# EAGLE design EDCPSU (EAGLE 9.5.2)
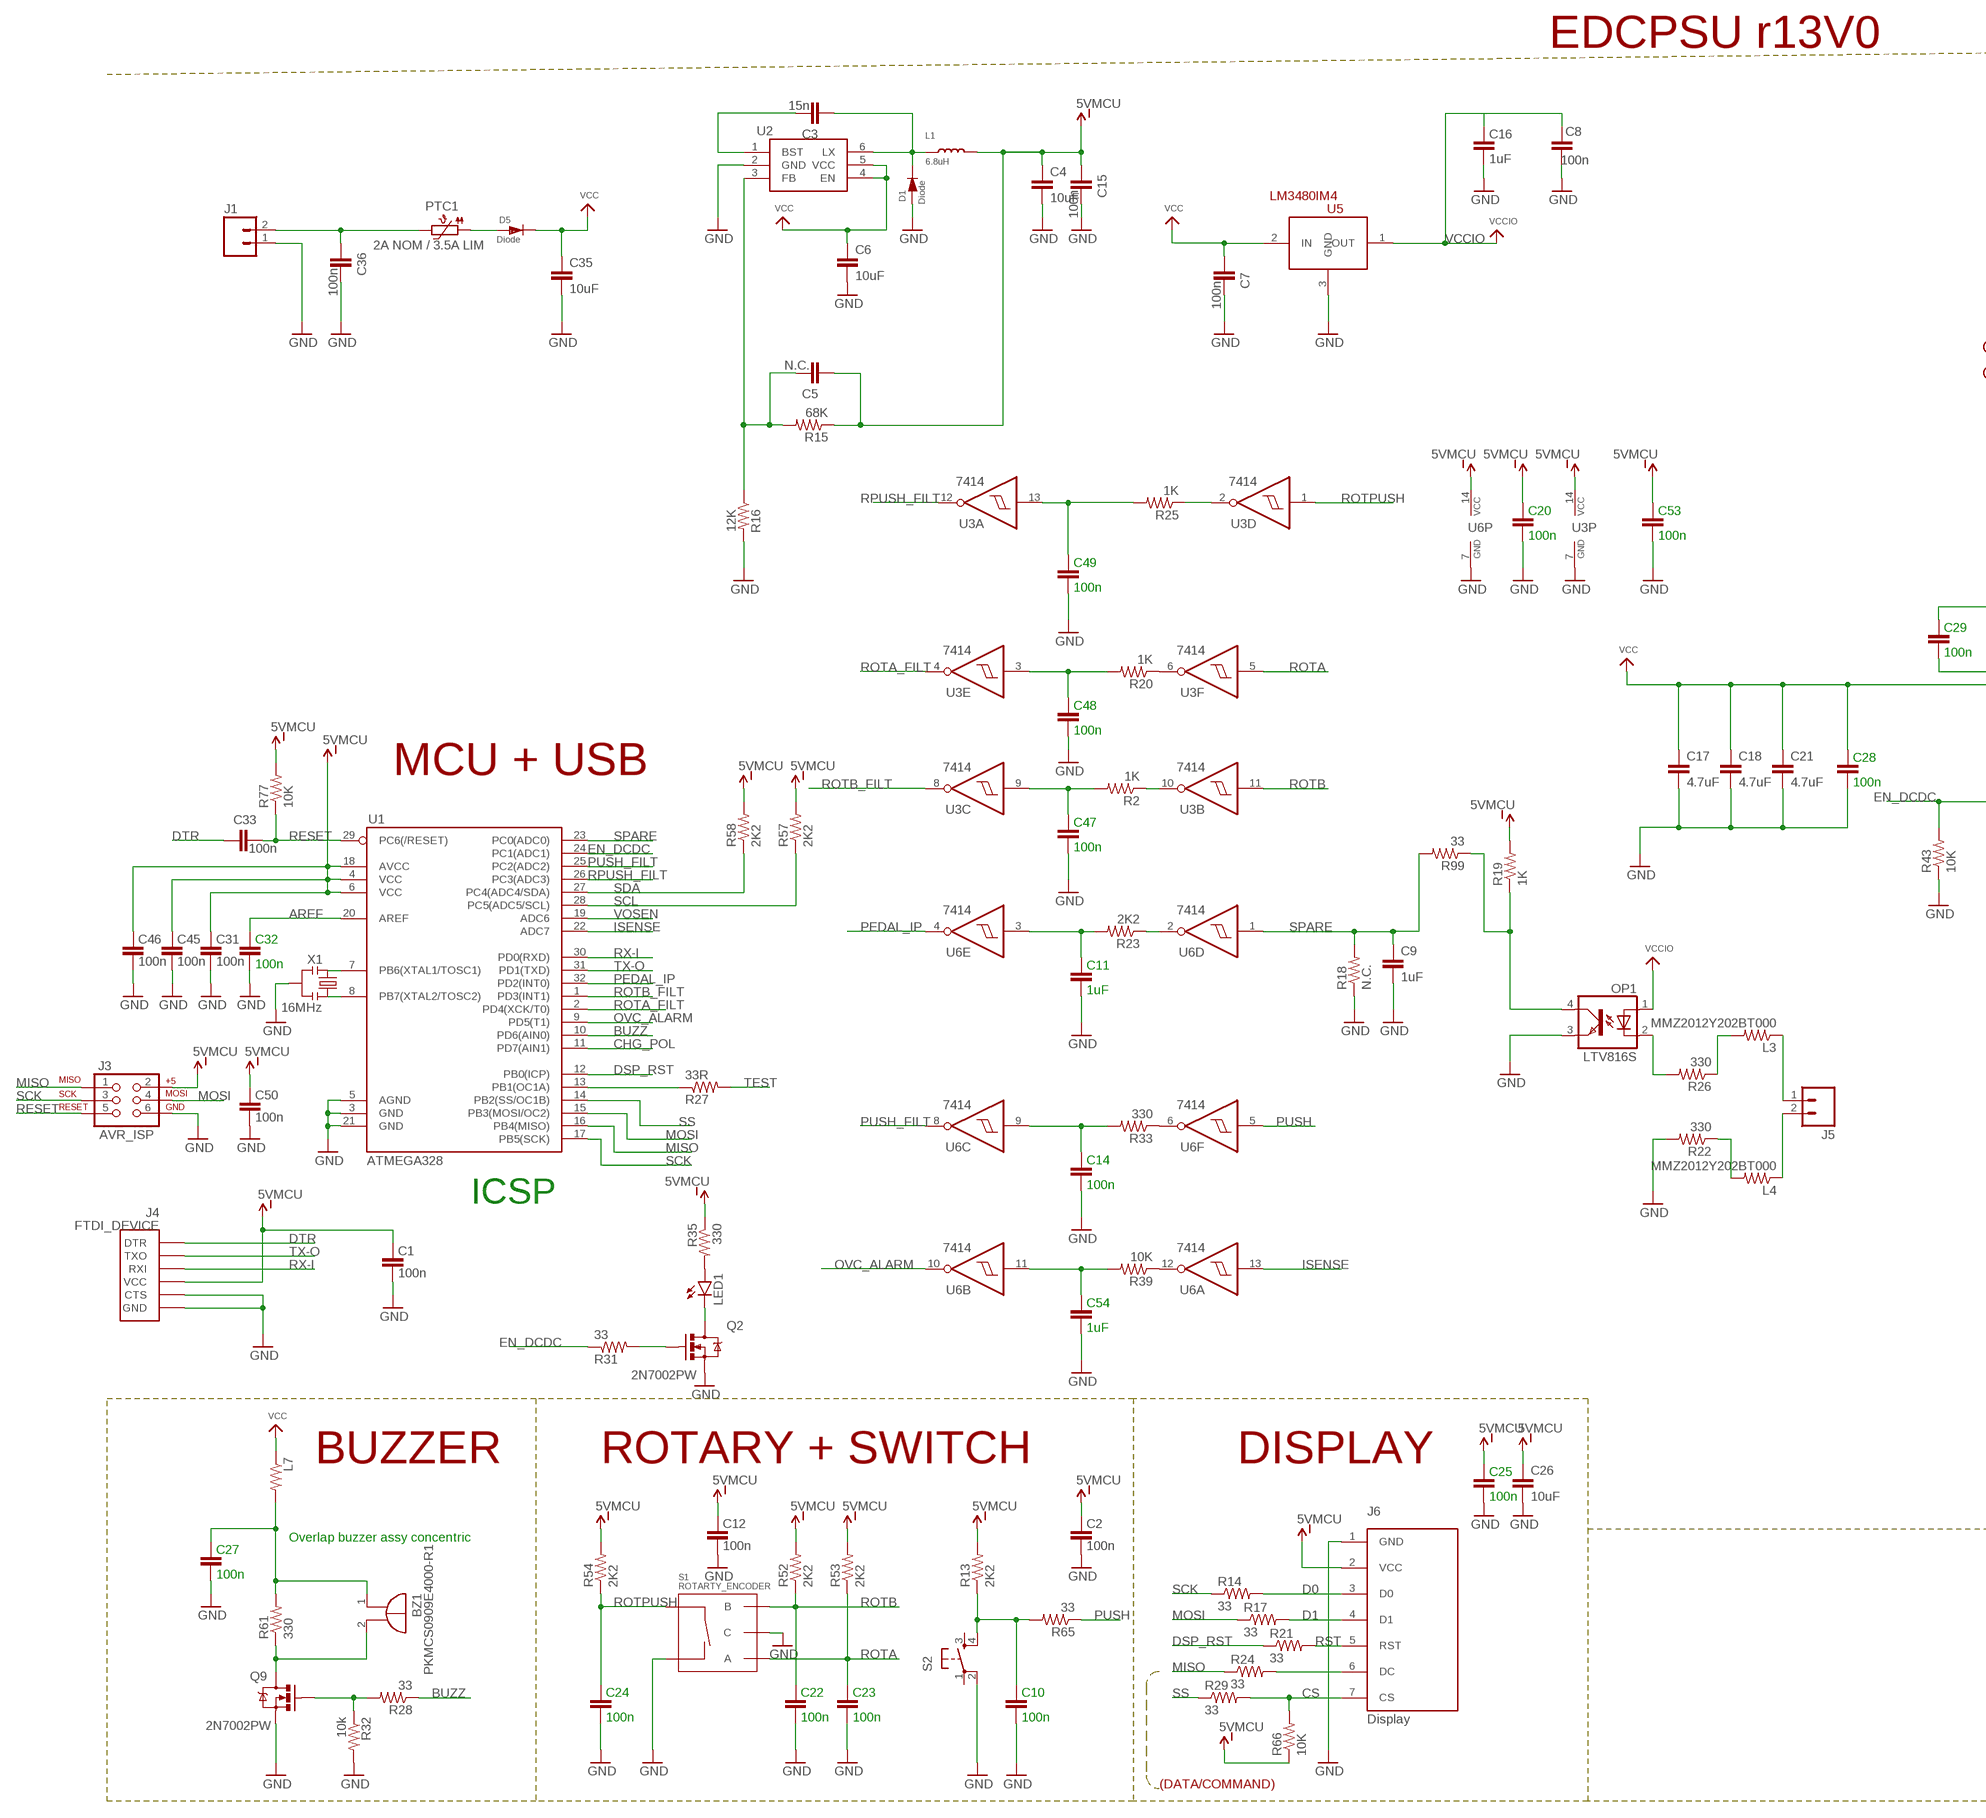
[diagram p0: schematic, sheet 1, part 1 of 2]
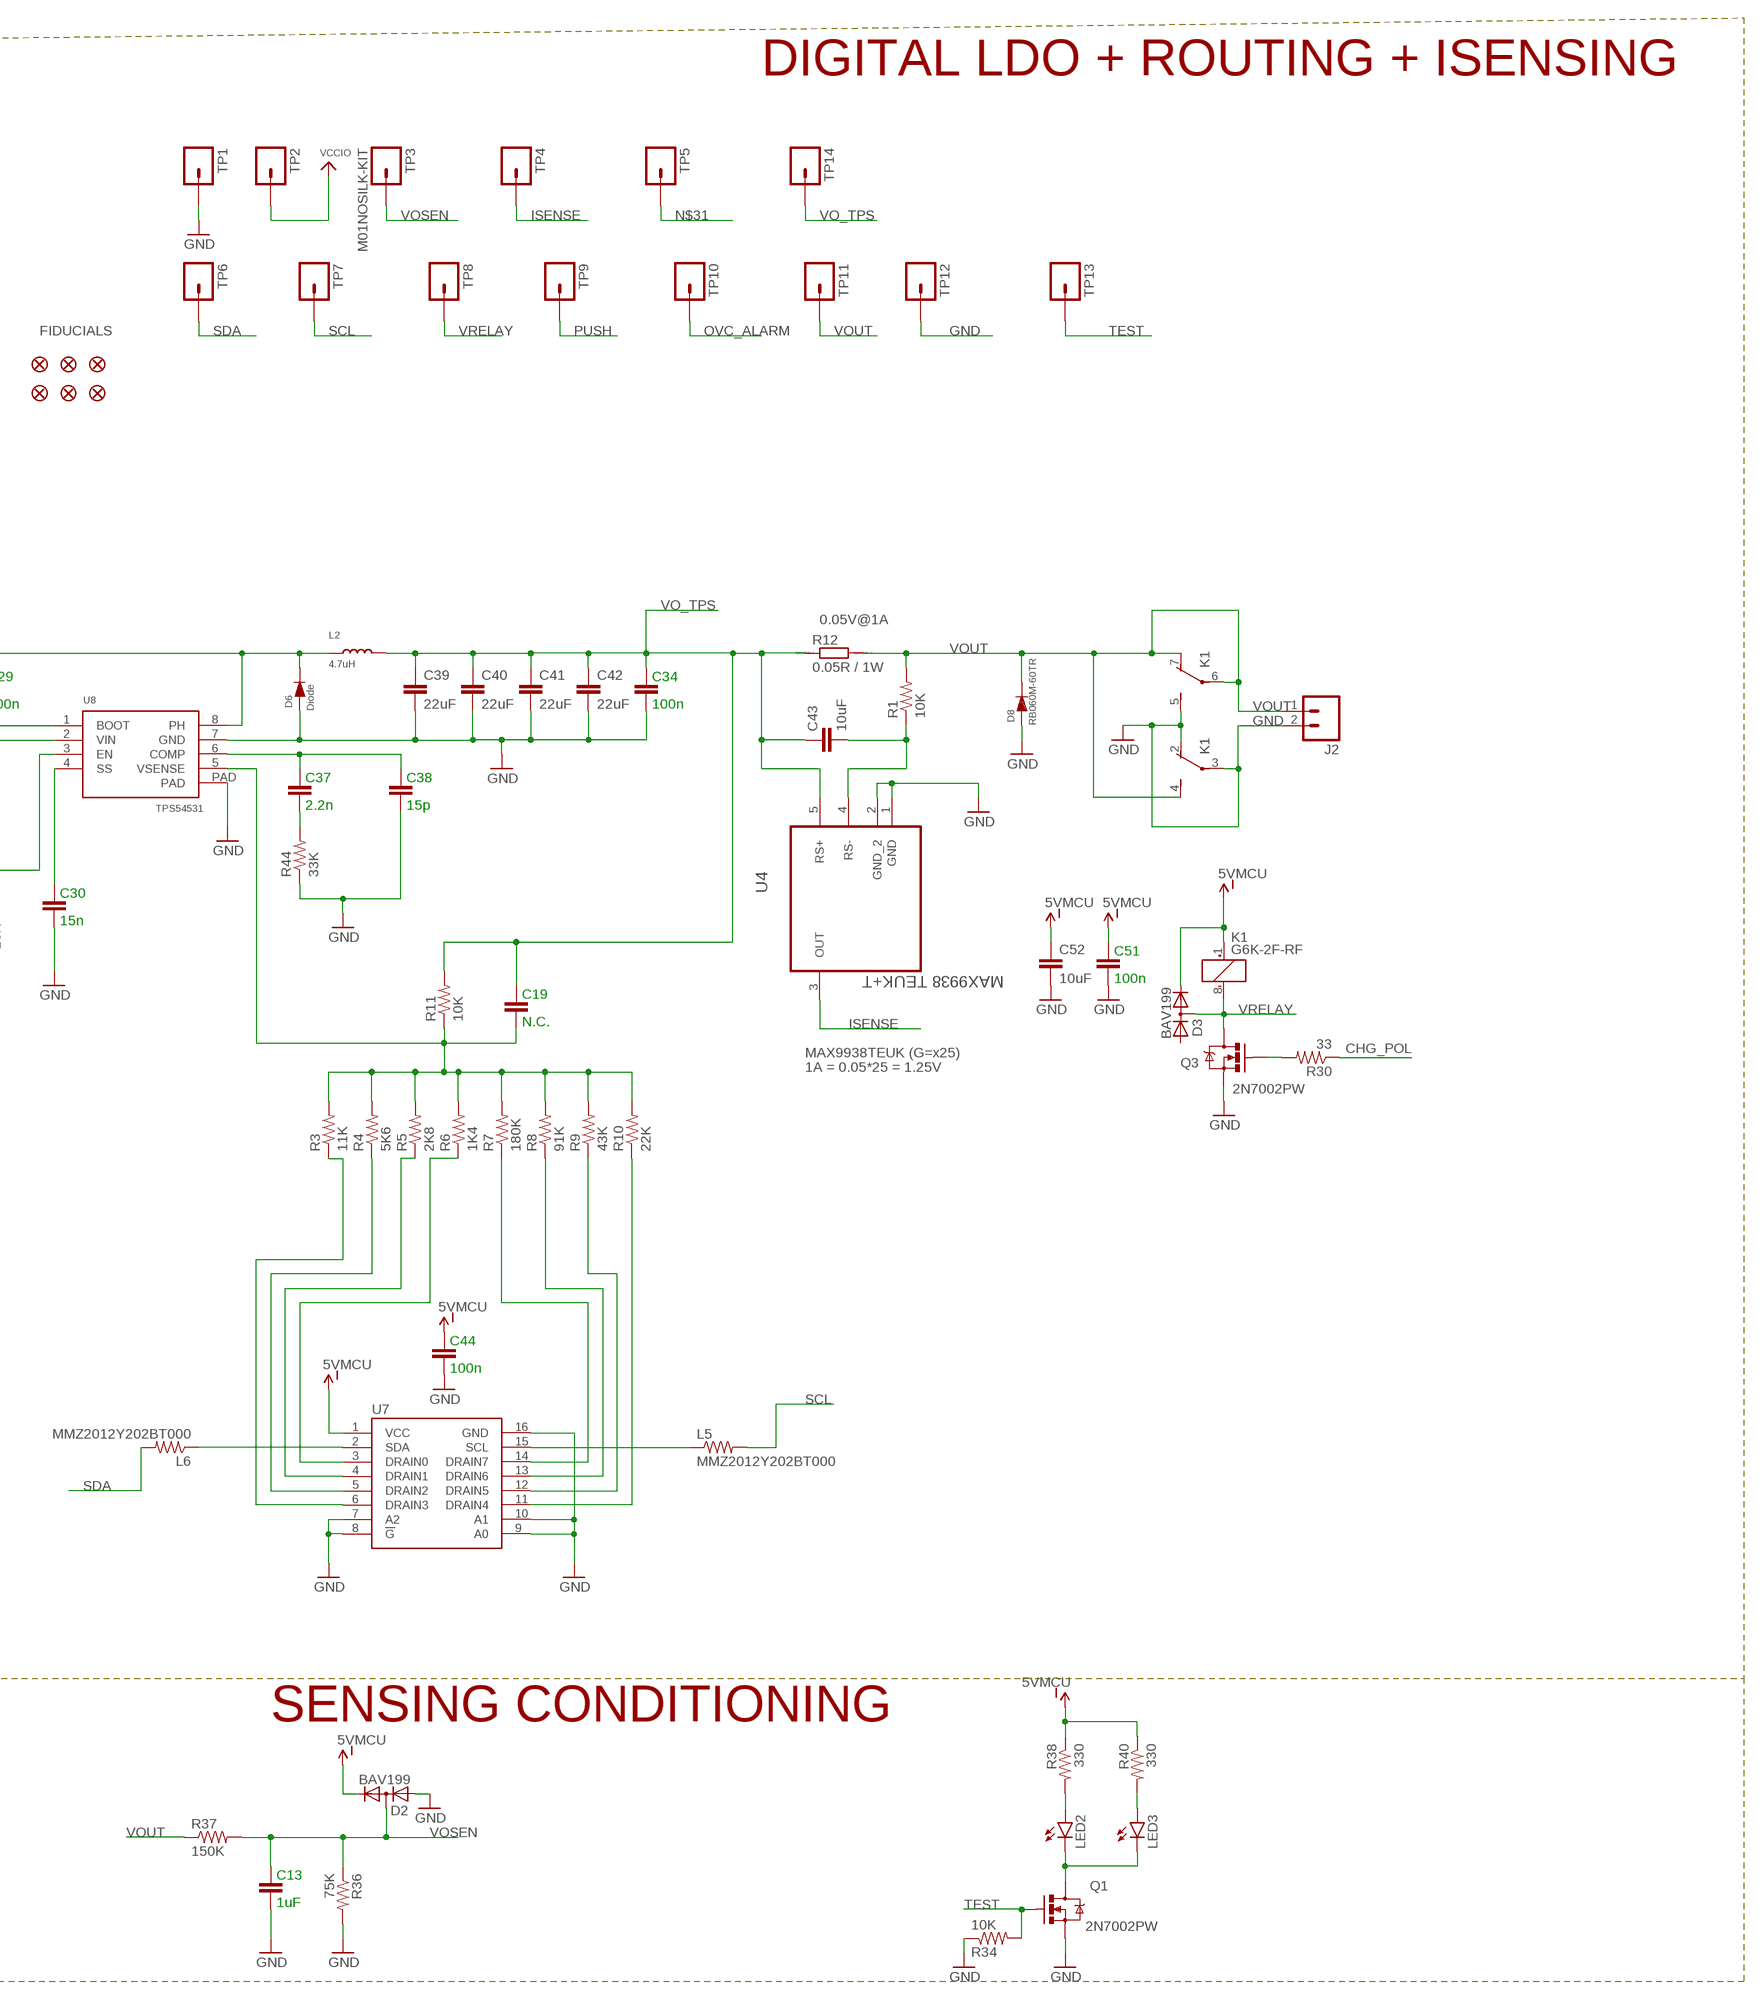
[diagram p1: schematic, sheet 1, part 2 of 2]

## Parts
BZ1  PKMCS0909E4000-R1  [PKMCS0909]
C1  100n  CAP0805  [0805]
C2  100n  CAP0805  [0805]
C3  15n  CAP0805  [0805]
C4  10uF  CAP1206  [1206]
C5  N.C.  CAP0805  [0805]
C6  10uF  CAP1206  [1206]
C7  100n  CAP0805  [0805]
C8  100n  CAP0805  [0805]
C9  1uF  CAP1206  [1206]
C10  100n  CAP0805  [0805]
C11  1uF  CAP0805  [0805]
C12  100n  CAP0805  [0805]
C13  1uF  CAP0805  [0805]
C14  100n  CAP0805  [0805]
C15  100n  CAP0805  [0805]
C16  1uF  CAP0805  [0805]
C17  4.7uF  CAP1210  [1210]
C18  4.7uF  CAP1210  [1210]
C19  N.C.  CAP0805  [0805]
C20  100n  CAP0805  [0805]
C21  4.7uF  CAP1210  [1210]
C22  100n  CAP0805  [0805]
C23  100n  CAP0805  [0805]
C24  100n  CAP0805  [0805]
C25  100n  CAP0805  [0805]
C26  10uF  CAP1206  [1206]
C27  100n  CAP0805  [0805]
C28  100n  CAP0805  [0805]
C29  100n  CAP0805  [0805]
C30  15n  CAP0805  [0805]
C31  100n  CAP0805  [0805]
C32  100n  CAP0805  [0805]
C33  100n  CAP0805  [0805]
C34  100n  CAP0805  [0805]
C35  10uF  CAP1206  [1206]
C36  100n  CAP0805  [0805]
C37  2.2n  CAP0805  [0805]
C38  15p  CAP0805  [0805]
C39  22uF  CAP1210  [1210]
C40  22uF  CAP1210  [1210]
C41  22uF  CAP1210  [1210]
C42  22uF  CAP1210  [1210]
C43  10uF  CAP1206  [1206]
C44  100n  CAP0805  [0805]
C45  100n  CAP0805  [0805]
C46  100n  CAP0805  [0805]
C47  100n  CAP0805  [0805]
C48  100n  CAP0805  [0805]
C49  100n  CAP0805  [0805]
C50  100n  CAP0805  [0805]
C51  100n  CAP0805  [0805]
C52  10uF  CAP1206  [1206]
C53  100n  CAP0805  [0805]
C54  1uF  CAP0805  [0805]
D1  Diode  DSOD123  [SOD123]
D2  BAV199  [SOT23]
D3  BAV199  [SOT23]
D5  Diode  DSMC  [DO-214AB]
D6  Diode  DSMC  [DO-214AB]
D8  RB060M-60TR  DSMA  [SMADIODE]
FID1  FIDUCIAL1X2  [FIDUCIAL-1X2]
FID2  FIDUCIAL1X2  [FIDUCIAL-1X2]
FID3  FIDUCIAL1X2  [FIDUCIAL-1X2]
FID4  FIDUCIAL1X2  [FIDUCIAL-1X2]
FID5  FIDUCIAL1X2  [FIDUCIAL-1X2]
FID6  FIDUCIAL1X2  [FIDUCIAL-1X2]
J1  M02LOCK_LONGPADS  [1X02_LOCK_LONGPADS]
J2  M02LOCK_LONGPADS  [1X02_LOCK_LONGPADS]
J3  AVR_ISP  AVR_SPI_PRG_6PTH  [2X3]
J4  FTDI_DEVICE  [FTDI_DEVICE_SIDE]
J5  M02LOCK_LONGPADS  [1X02_LOCK_LONGPADS]
J6  Display  OLED_LCD  [OLED_LCD]
K1  G6K-2F-RF  [G6K-RF]
L1  6.8uH  L4018  [NR4018T100M]
L2  4.7uH  L74437368047  [WE-LHMI]
L3  MMZ2012Y202BT000  RESISTOR0805-RES  [0805]
L4  MMZ2012Y202BT000  RESISTOR0805-RES  [0805]
L5  MMZ2012Y202BT000  RESISTOR0805-RES  [0805]
L6  MMZ2012Y202BT000  RESISTOR0805-RES  [0805]
L7  MMZ2012Y202BT000  RESISTOR0805-RES  [0805]
LED1  LED3MM  [LED3MM]
LED2  LED5MM  [LED5MM]
LED3  LED5MM  [LED5MM]
OP1  LTV816S  [SMD4]
PTC1  2A NOM / 3.5A LIM  PTC-  [1812L]
Q1  2N7002PW  MOSFET-NCHANNEL2N7002PW  [SOT323]
Q2  2N7002PW  MOSFET-NCHANNEL2N7002PW  [SOT323]
Q3  2N7002PW  MOSFET-NCHANNEL2N7002PW  [SOT323]
Q9  2N7002PW  MOSFET-NCHANNEL2N7002PW  [SOT323]
R1  10K  RESISTOR0805-RES  [0805]
R2  1K  RESISTOR0805-RES  [0805]
R3  11K  RESISTOR0805-RES  [0805]
R4  5K6  RESISTOR0805-RES  [0805]
R5  2K8  RESISTOR0805-RES  [0805]
R6  1K4  RESISTOR0805-RES  [0805]
R7  180K  RESISTOR0805-RES  [0805]
R8  91K  RESISTOR0805-RES  [0805]
R9  43K  RESISTOR0805-RES  [0805]
R10  22K  RESISTOR0805-RES  [0805]
R11  10K  RESISTOR0805-RES  [0805]
R12  0.05R / 1W  RR2512  [R2512]
R13  2K2  RESISTOR0805-RES  [0805]
R14  33  RESISTOR0805-RES  [0805]
R15  68K  RESISTOR0805-RES  [0805]
R16  12K  RESISTOR0805-RES  [0805]
R17  33  RESISTOR0805-RES  [0805]
R18  N.C.  RESISTOR0805-RES  [0805]
R19  1K  RESISTOR0805-RES  [0805]
R20  1K  RESISTOR0805-RES  [0805]
R21  33  RESISTOR0805-RES  [0805]
R22  330  RESISTOR1206  [1206]
R23  2K2  RESISTOR0805-RES  [0805]
R24  33  RESISTOR0805-RES  [0805]
R25  1K  RESISTOR0805-RES  [0805]
R26  330  RESISTOR1206  [1206]
R27  33R  RESISTOR0805-RES  [0805]
R28  33  RESISTOR0805-RES  [0805]
R29  33  RESISTOR0805-RES  [0805]
R30  33  RESISTOR0805-RES  [0805]
R31  33  RESISTOR0805-RES  [0805]
R32  10k  RESISTOR0805-RES  [0805]
R33  330  RESISTOR0805-RES  [0805]
R34  10K  RESISTOR0805-RES  [0805]
R35  330  RESISTOR0805-RES  [0805]
R36  75K  RESISTOR0805-RES  [0805]
R37  150K  RESISTOR0805-RES  [0805]
R38  330  RESISTOR0805-RES  [0805]
R39  10K  RESISTOR0805-RES  [0805]
R40  330  RESISTOR0805-RES  [0805]
R43  10K  RESISTOR0805-RES  [0805]
R44  33K  RESISTOR0805-RES  [0805]
R52  2K2  RESISTOR0805-RES  [0805]
R53  2K2  RESISTOR0805-RES  [0805]
R54  2K2  RESISTOR0805-RES  [0805]
R57  2K2  RESISTOR0805-RES  [0805]
R58  2K2  RESISTOR0805-RES  [0805]
R61  330  RESISTOR0805-RES  [0805]
R65  33  RESISTOR0805-RES  [0805]
R66  10K  RESISTOR0805-RES  [0805]
R77  10K  RESISTOR0805-RES  [0805]
R99  33  RESISTOR0805-RES  [0805]
S1  ROTARTY_ENCODER  [ROTARY_ENC_PLAIN]
S2  TAC_SWITCH_KSC931G-SMD  [TAC_SW_SMD_KSC931G]
TP1  M01POGOPIN_HOLE_LARGE  [1X01_POGOPIN_HOLE_LARGE]
TP2  M01POGOPIN_HOLE_LARGE  [1X01_POGOPIN_HOLE_LARGE]
TP3  M01NOSILK-KIT  [1X01NS-KIT]
TP4  M01POGOPIN_HOLE_LARGE  [1X01_POGOPIN_HOLE_LARGE]
TP5  M01POGOPIN_HOLE_LARGE  [1X01_POGOPIN_HOLE_LARGE]
TP6  M01POGOPIN_HOLE_LARGE  [1X01_POGOPIN_HOLE_LARGE]
TP7  M01POGOPIN_HOLE_LARGE  [1X01_POGOPIN_HOLE_LARGE]
TP8  M01POGOPIN_HOLE_LARGE  [1X01_POGOPIN_HOLE_LARGE]
TP9  M01POGOPIN_HOLE_LARGE  [1X01_POGOPIN_HOLE_LARGE]
TP10  M01POGOPIN_HOLE_LARGE  [1X01_POGOPIN_HOLE_LARGE]
TP11  M01POGOPIN_HOLE_LARGE  [1X01_POGOPIN_HOLE_LARGE]
TP12  M01POGOPIN_HOLE_LARGE  [1X01_POGOPIN_HOLE_LARGE]
TP13  M01POGOPIN_HOLE_LARGE  [1X01_POGOPIN_HOLE_LARGE]
TP14  M01POGOPIN_HOLE_LARGE  [1X01_POGOPIN_HOLE_LARGE]
U1  ATMEGA328  ATMEGA168  [TQFP32-08]
U2  BD9G101G  [SSOP6]
U3  7414  [TSSOP14]
U4  MAX9938 TEUK+T  MAX9938FEUK+T  [SOT95P280X145-5N]
U5  LM3480IM4  [SOT23-3]
U6  7414  [TSSOP14]
U7  TPIC2810D  [SO16]
U8  TPS54531  TPS5431DDAR  [SOIC8]
X1  16MHz  RESONATORSMD  [RESONATOR-SMD]

## Nets
AREF: C32.2 U1.20(AREF)
BUZZ: R28.1 U1.10(PD6(AIN0))
CHG_POL: R30.1 U1.11(PD7(AIN1))
CS: J6.7(CS) R29.2 R66.2
D0: J6.3(D0) R14.2
D1: J6.4(D1) R17.2
DSP_RST: R21.1 U1.12(PB0(ICP))
DTR: C33.2 J4.P$1(DTR)
EN_DCDC: R31.1 R43.2 U1.24(PC1(ADC1)) U8.3(EN)
GND: C1.1 C2.1 C4.2 C6.2 C7.1 C8.1 C9.2 C10.1 C11.1 C12.1 C13.1 C14.1 C15.1 C16.1 C17.2 C18.2 C20.1 C21.2 C22.1 C23.1 C24.1 C25.1 C26.2 C27.1 C28.1 C30.1 C31.1 C32.1 C34.1 C35.2 C36.1 C38.1 C39.2 C40.2 C41.2 C42.2 C44.1 C45.1 C46.1 C47.1 C48.1 C49.1 C50.1 C51.1 C52.2 C53.1 C54.1 D1.+(A) D2.1(A) D6.1(A) D8.A J1.1 J2.2 J3.6 J4.P$5(CTS) J4.P$6(GND) J6.1(GND) K1.2(A:O) K1.3(A:P) K1.5(B:S) OP1.3(EMIT) Q1.2(S) Q2.2(S) Q3.2(S) Q9.2(S) R16.2 R18.1 R22.2 R32.2 R34.1 R36.2 R43.1 R44.1 S1.C S1.SW- S2.2 TP1.1 TP12.1 U1.3(GND) U1.5(AGND) U1.21(GND) U2.2(GND) U3.7(P:GND) U4.1(GND) U4.2(GND_2) U5.3(GND) U6.7(P:GND) U7.7(A2) U7.8(!G) U7.9(A0) U7.10(A1) U7.16(GND) U8.7(GND) U8.PAD X1.2
ISENSE: TP4.1 U1.22(ADC7) U4.3(OUT) U6.13(A:I)
MISO: J3.1 R24.1 U1.16(PB4(MISO))
MOSI: J3.4 R17.1 U1.15(PB3(MOSI/OC2))
N$1: R3.1 U7.6(DRAIN3)
N$2: R4.1 U7.5(DRAIN2)
N$3: R5.1 U7.4(DRAIN1)
N$4: R6.1 U7.3(DRAIN0)
N$5: R7.1 U7.14(DRAIN7)
N$6: J6.6(DC) R24.2
N$7: R8.1 U7.13(DRAIN6)
N$8: R9.1 U7.12(DRAIN5)
N$9: R10.1 U7.11(DRAIN4)
N$10: C43.2 R1.1 U4.4(RS-)
N$11: LED1.A R35.2
N$12: LED1.K(C) Q2.3(D)
N$13: R33.1 U6.6(F:O)
N$14: D5.1(A) PTC1.1
N$15: R39.1 U6.12(A:O)
N$16: C3.1 U2.1(BST)
N$17: C10.2 R13.1 R65.2 S2.4
N$18: C47.2 R2.2 U3.9(C:I)
N$19: C3.2 D1.-(K) L1.1 U2.6(LX)
N$20: Q9.1(G) R28.2 R32.1
N$21: Q2.1(G) R31.2
N$22: R2.1 U3.10(B:O)
N$23: R20.1 U3.6(F:O)
N$24: U1.8(PB7(XTAL2/TOSC2)) X1.1
N$25: R25.1 U3.2(D:O)
N$26: C49.2 R25.2 U3.13(A:I)
N$27: C5.1 R15.2 R16.1 U2.3(FB)
N$28: C48.2 R20.2 U3.3(E:I)
N$29: C11.2 R23.2 U6.3(E:I)
N$30: R27.1 U1.13(PB1(OC1A))
N$31: OP1.4(COL) R19.1 R99.1 TP5.1
N$32: BZ1.1(+) C27.2 L7.2 R61.2
N$33: C36.2 J1.2 PTC1.2
N$34: R23.1 U6.2(D:O)
N$36: U1.7(PB6(XTAL1/TOSC1)) X1.3
N$37: C14.2 R33.2 U6.9(C:I)
N$38: LED2.A R38.2
N$39: C54.2 R39.2 U6.11(B:I)
N$40: L6.1 U7.2(SDA)
N$41: OP1.2(C) R26.2
N$42: Q3.1(G) R30.2
N$43: L3.2 R26.1
N$44: C30.2 U8.4(SS)
N$46: L4.2 R22.1
N$47: C29.1 U8.1(BOOT)
N$48: C19.1 R3.2 R4.2 R5.2 R6.2 R7.2 R8.2 R9.2 R10.2 R11.1 U8.5(VSENSE)
N$49: LED3.A R40.2
N$51: C29.2 D6.2(K) L2.1 U8.8(PH)
N$52: C37.2 C38.2 U8.6(COMP)
N$53: C37.1 R44.2
N$54: L5.1 U7.15(SCL)
N$55: J5.1 L3.1
N$56: J5.2 L4.1
N$57: LED2.K(C) LED3.K(C) Q1.3(D)
N$64: BZ1.2(-) Q9.3(D) R61.1
OVC_ALARM: TP10.1 U1.9(PD5(T1)) U6.10(B:O)
PEDAL_IP: U1.32(PD2(INT0)) U6.4(E:O)
PUSH: R65.1 TP9.1 U6.5(F:I)
PUSH_FILT: U1.25(PC2(ADC2)) U6.8(C:O)
RESET: C33.1 J3.5 R77.1 U1.29(PC6(/RESET))
ROTA: C23.2 R53.1 S1.A U3.5(F:I)
ROTA_FILT: U1.2(PD4(XCK/T0)) U3.4(E:O)
ROTB: C22.2 R52.1 S1.B U3.11(B:I)
ROTB_FILT: U1.1(PD3(INT1)) U3.8(C:O)
ROTPUSH: C24.2 R54.1 S1.SW+ U3.1(D:I)
RPUSH_FILT: U1.26(PC3(ADC3)) U3.12(A:O)
RST: J6.5(RST) R21.2
RX-I: J4.P$3(RXI) U1.30(PD0(RXD))
SCK: J3.3 R14.1 U1.17(PB5(SCK))
SCL: L5.2 R57.1 TP7.1 U1.28(PC5(ADC5/SCL))
SDA: L6.2 R58.1 TP6.1 U1.27(PC4(ADC4/SDA))
SPARE: C9.1 R18.2 R99.2 U1.23(PC0(ADC0)) U6.1(D:I)
SS: R29.1 U1.14(PB2(SS/OC1B))
TEST: Q1.1(G) R27.2 R34.2 TP13.1
TX-O: J4.P$2(TXO) U1.31(PD1(TXD))
VCC: C6.1 C7.2 C17.1 C18.1 C21.1 C28.2 C35.1 D5.2(K) L7.1 U2.4(EN) U2.5(VCC) U5.2(IN) U8.2(VIN)
VCC-ISO: C1.2 C2.2 C4.1 C5.2 C12.2 C15.2 C20.2 C25.2 C26.1 C31.2 C44.2 C45.2 C46.2 C50.2 C51.2 C52.1 C53.2 D2.2(C) D3.2(C) J3.2 J4.P$4(VCC) J6.2(VCC) K1.1(1:+) L1.2 R13.2 R15.1 R19.2 R35.1 R38.1 R40.1 R52.2 R53.2 R54.2 R57.2 R58.2 R66.1 R77.2 U1.4(VCC) U1.6(VCC) U1.18(AVCC) U3.14(P:VCC) U6.14(P:VCC) U7.1(VCC) ; supply symbol labelled 5VMCU
VCCIO: C8.2 C16.2 OP1.1(A) TP2.1 U5.1(OUT)
VO_TPS: C19.2 C34.2 C39.1 C40.1 C41.1 C42.1 C43.1 L2.2 R11.2 R12.1 TP14.1 U4.5(RS+)
VOSEN: C13.2 D2.3(AC) R36.1 R37.2 TP3.1 U1.19(ADC6)
VOUT: D8.C(K) J2.1 K1.4(A:S) K1.6(B:P) K1.7(B:O) R1.2 R12.2 R37.1 TP11.1
VRELAY: D3.3(AC) K1.8(1:-) Q3.3(D) TP8.1
Unconnected: D3.1(A) K1.A(S1:SH) K1.B(S2:SH) S2.1 S2.3

## Notes on the sheet
- EDCPSU r13V0
- DIGITAL LDO + ROUTING + ISENSING
- FIDUCIALS
- 0.05V@1A
- MCU + USB
- MAX9938TEUK (G=x25)
- 1A = 0.05*25 = 1.25V
- ICSP
- BUZZER | ROTARY + SWITCH | DISPLAY
- Overlap buzzer assy concentric
- SENSING CONDITIONING
- (DATA/COMMAND)

## Library data of the parts
BZ1 = buzzer:PKMCS0909E4000-R1: PKMCS0909E4000-R1 Source : http://www.murata.com/~/media/webrenewal/products/sound/sounder/vppt-buzj083-d.ashx
C1-C3 C5 C7 C8 C10-C16 C19 C20 C22-C25 C27-C34 C36-C38 C44-C51 C53 C54 = SparkFun:CAP: Capacitor Standard 0603 ceramic capacitor, and 0.1" leaded capacitor.
C4 C6 C9 C17 C18 C21 C26 C35 C39-C43 C52 = SparkFun-Passives:CAP: Capacitor Standard 0603 ceramic capacitor, and 0.1" leaded capacitor.
D1 D5 D6 D8 = EDCPSU - Rev3:D*
D2 D3 = diode:BAV199: DIODE low-leakage double diode
FID1-FID6 = SparkFun-Aesthetics:FIDUCIAL: Fiducial Alignment Points Various fiducial points for machine vision alignment.
J1 J2 J5 = SparkFun-Connectors:M02: Standard 2-pin 0.1" header. Use with - straight break away headers ( PRT-00116) - right angle break away headers (PRT-00553) - swiss pins (PRT-00743) - machine pins (PRT-00117) - female headers (PRT-00115) Molex polarized connector foot print use with: PRT-08233 with associated crimp pins and housings. 2.54_SCREWTERM for use with PRT-10571. 3.5mm Screw Terminal footprints for PRT-08084 5mm Screw Terminal footprints for use with PRT-08433
J3 = SparkFun-Connectors:AVR_SPI_PRG_6: AVR ISP 6 Pin This is the reduced ISP connector for AVR programming. Common on Arduino. This footprint will take up less PCB space and can be used with a 10-pin to 6-pin adapter such as SKU: BOB-08508 **Special note about "TEST_POINT" package. The stop mask is on the top side, so if you want your programming test points to be on the bottom of your board, make sure to place this package on the bottom side of the board. This also ensure that the orientation to program from the bottom side will be correct.
J4 = SparkFun-Connectors:FTDI_DEVICE: Connector which mates to FTDI basic or FTDI cable.
J6 = EDCPSU:OLED_LCD
K1 = relay:G6K*-2F-RF: OMRON High Frequency Relay G6K-RF Compact High Frequency Relays with 2 Form C (DPDT) Contacts Handles 1 A, 30 VDC discrete load and 1 W at 1 GHz high frequency load D20G6KRF0602.pdf; MF: OMRON COMPONENTS USA; MPN: G6K-2F-RF-DC12; OC_FARNELL: 1448181; OC_NEWARK: 73C8948
L1 L2 = EDCPSU - Rev3:L*
L3-L7 R1-R11 R13-R21 R23-R25 R27-R40 R43 R44 R52-R54 R57 R58 R61 R65 R66 R77 R99 = SparkFun:RESISTOR: Resistor Basic schematic elements and footprints for 0603, 1206, and PTH resistors.
LED1-LED3 = SparkFun-LED:LED: LEDs Standard schematic elements and footprints for 5mm, 3mm, 1206, and 0603 sized LEDs. 5mm - Spark Fun Electronics SKU : COM-00529 (and others)
OP1 = optocoupler:LTV816: OPTO COUPLER Source: LITEON, LTV816.pdf; OC_FARNELL: unknown; OC_NEWARK: unknown
PTC1 = EDCPSU:PTC-: Positive Temperature Coefficient Resistor (PTC) PTC Littlefuse 1812L200THPR - Resetteable Fuse 3.5A.pdf
Q1-Q3 Q9 = SparkFun-DiscreteSemi:MOSFET-NCHANNEL: Common NMOSFET Parts MFG P/N Store ID Prod ID FDD8780 TRANS-09984 SI7820DN TRANS-11055 FDS6630A IC-08089 2N7002PW TRANS-11151 FQP30N06L COM-10213 TRANS-10060 BSS123LT1G TRANS-08345 BSS138 TRANS-00830 BS170 2N7000; PROD_ID: TRANS-11151
R12 = eagle-ltspice:R: RESISTOR, European symbol; SPICEMODEL: NONE; SPICEPREFIX: R
R22 R26 = SparkFun-Passives:RESISTOR: Resistor Basic schematic elements and footprints for 0603, 1206, and PTH resistors.
S1 = SparkFun-Electromechanical:ROTARTY_ENCODER: Simple no LED rotary encoder Example: COM-09117
S2 = EDCPSU - Rev2:TAC_SWITCH: Momentary Switch Button commonly used for reset or general input. Spark Fun Electronics SKU : COM-00097 SMT- SWCH-08247
TP1-TP14 = SparkFun-Connectors:M01: Header 1 Standard 1-pin 0.1" header. Use with straight break away headers (SKU : PRT-00116), right angle break away headers (PRT-00553), swiss pins (PRT-00743), machine pins (PRT-00117), and female headers (PRT-00115).
U1 = SparkFun:ATMEGA168
U2 = EDCPSU - Rev3:BD9G101G: BD9G101G - Simple Step-down Switching Regulators with Built-in Power MOSFET
U3 U6 = 74xx-eu:74*14: Hex schmitt trigger INVERTER
U4 = MAX9938:MAX9938FEUK+T; DESCRIPTION: Precision Current-Sense Amplifier; MPN: MAX9938FEUK+T; OC_FARNELL: -; OC_NEWARK: 01N6733; PACKAGE: SOT-23-5; SUPPLIER: Maxim
U5 = SparkFun-PowerIC:LM3480IM4: Small package linear regulator
U7 = EDCPSU - Rev2:TPIC2810D
U8 = EDCPSU - Rev3:TPS5431DDAR: Source : http://www.ti.com/lit/ds/symlink/tps54531.pdf
X1 = SparkFun:RESONATOR: Resonator Small SMD resonator. This is the itty bitty 10/20MHz resonators with built in caps. CSTCE10M0G55 and CSTCE20M0V53. Footprint has been reviewed closely but hasn't been tested yet.

## Net classes
1 vcc: width 0.254 mm

## Board
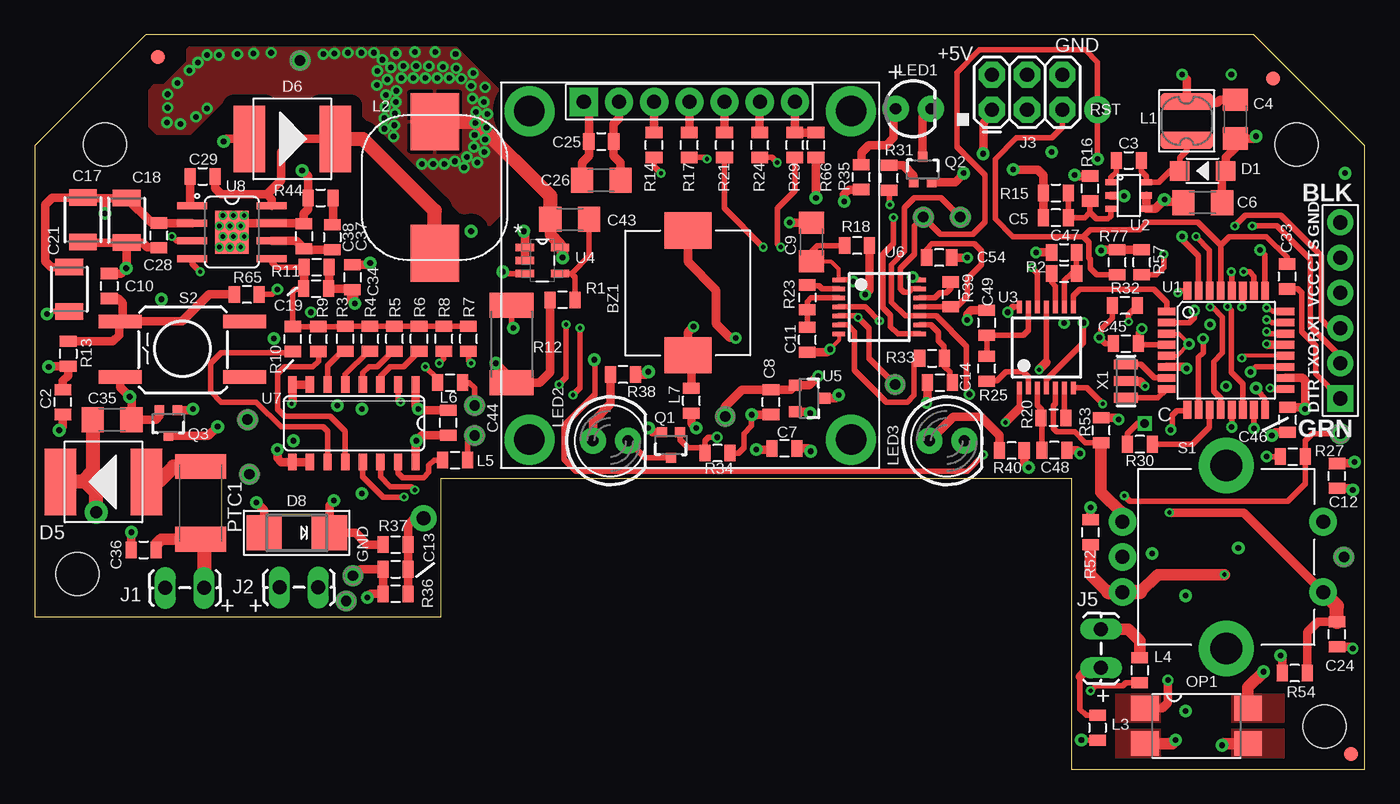
[diagram p2: board, top side]
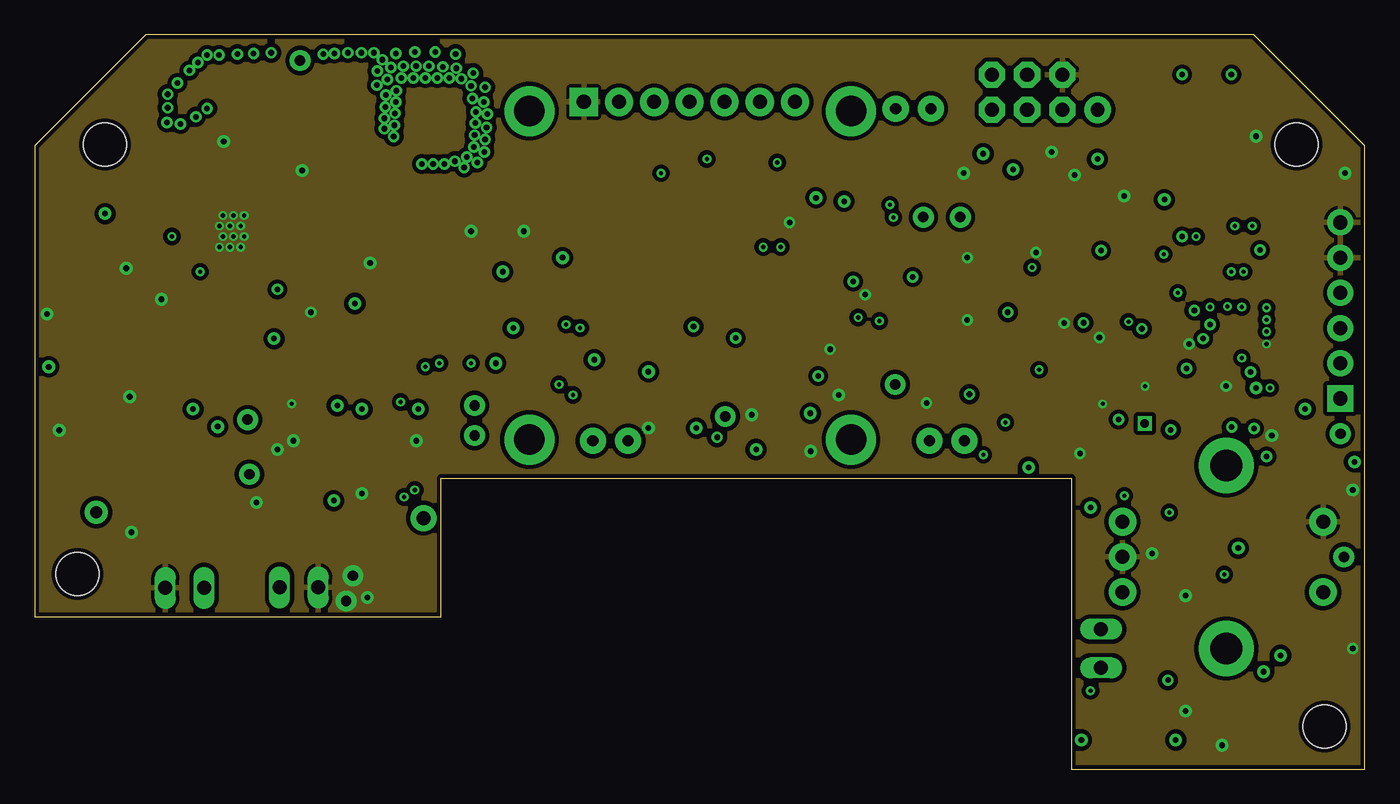
[diagram p3: board, inner layer GND]
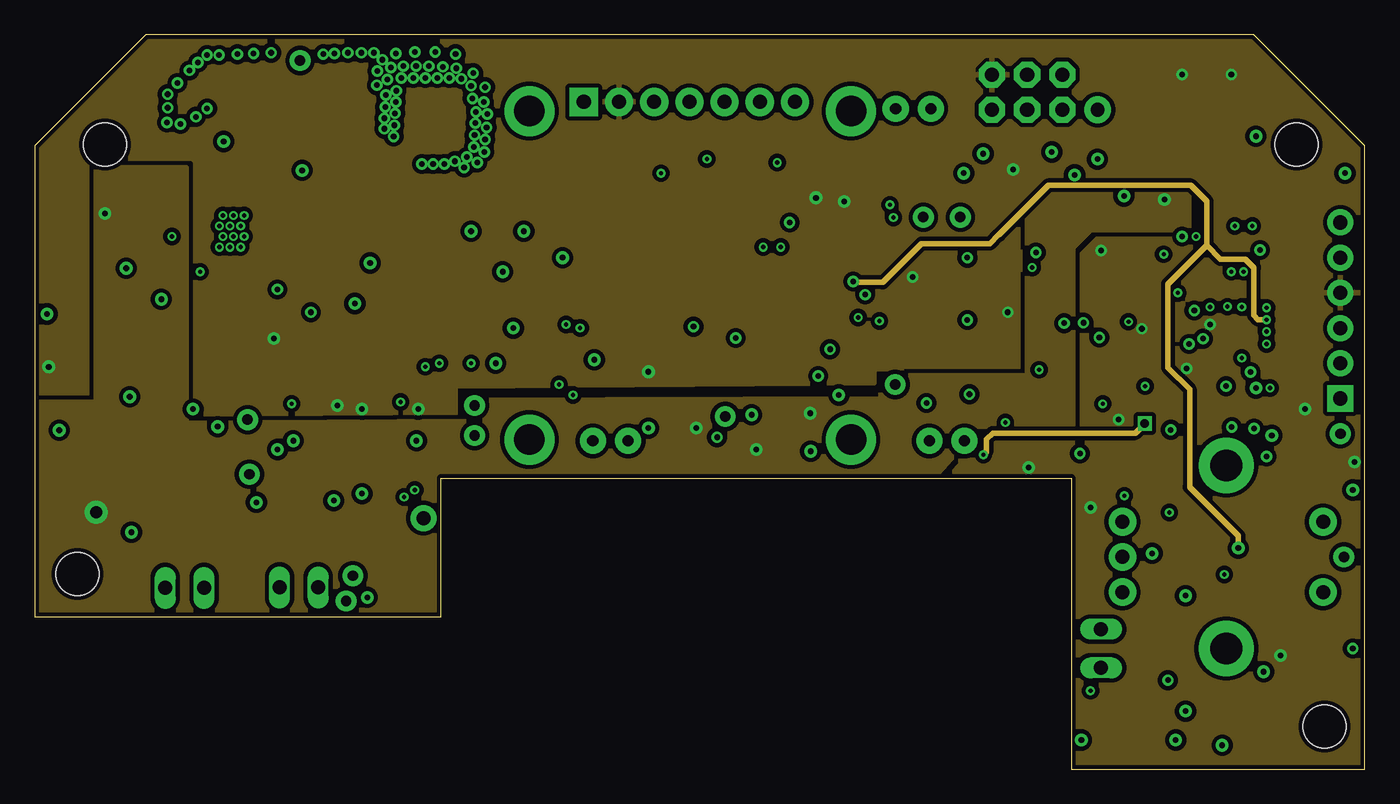
[diagram p4: board, inner layer PWR]
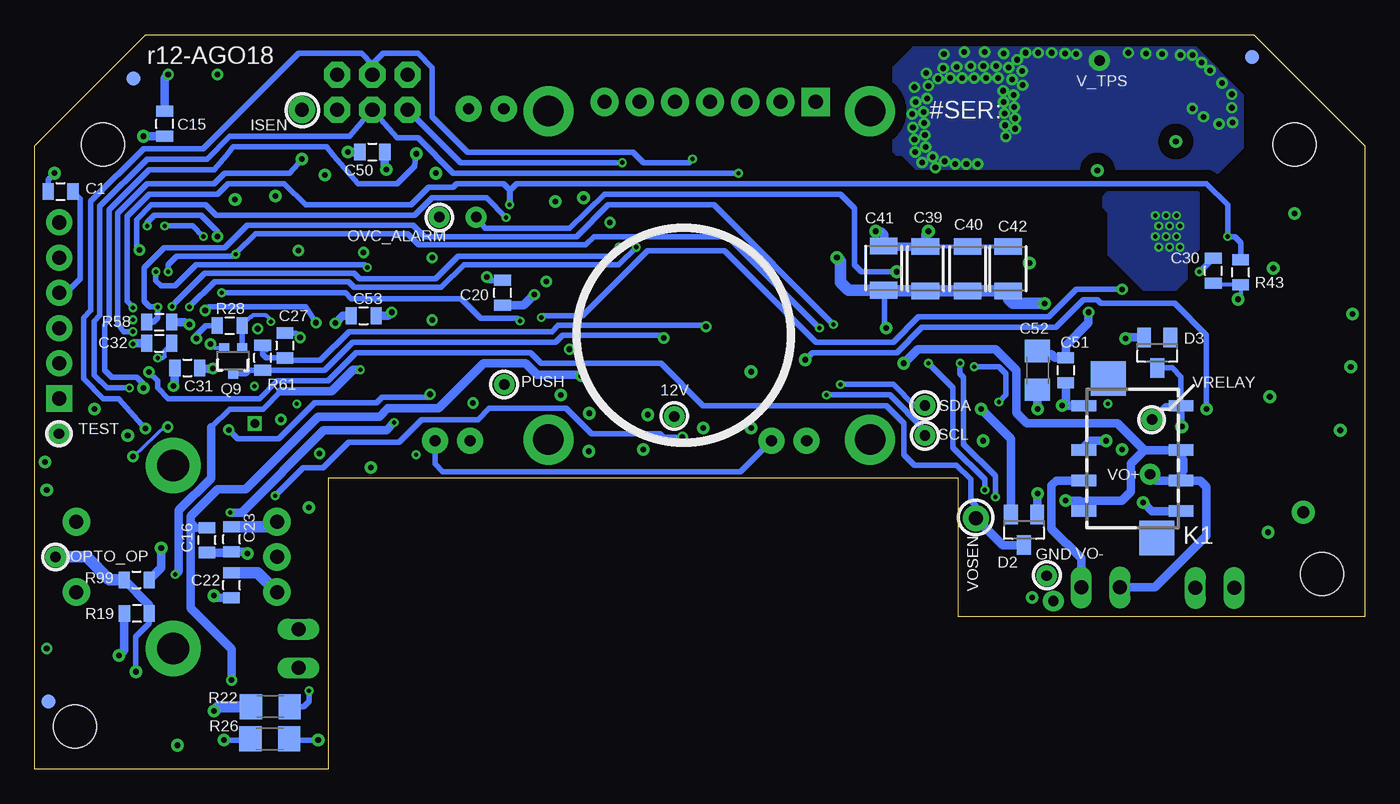
[diagram p5: board, bottom side, seen from below]

Size 96 x 53 mm. Coordinates in mm from the lower left corner, seen from the top.
Outline: 96,0 96,45 88,53 8,53 0,45 0,11 29.35,11 29.35,21 74.81,21 74.81,0 96,0
Copper layers (1*2*15*16): Top 0.035mm / dielectric 0.2mm / GND 0.0175mm / dielectric 0.3mm / PWR 0.0175mm / dielectric 0.2mm / Bottom 0.035mm
Design rules "SeeedStudio_4layer_DRU_no_angle_20140221": minimum track width 8mil, minimum drill 12mil, track to track 8mil, track to pad 8mil, pad to pad 8mil, via to via 8mil, smd to smd 0mil, copper to edge 10mil, drill to drill 8mil, minimum pad ring 6mil, minimum via ring 4mil, stop-mask expansion 4mil, vias tented up to drill 25mil, thermal gap 10mil
Holes 3.1 mm at 5.08,45.08 91.08,45.08 3.08,14.08 93.08,3.08

### Footprints (pad centres in the part's own frame; a part is rotated, then mirrored left to right if it is on the bottom)
PKMCS0909 = smd 2.6 x 3.4: 1 -4.5,0; 2 4.5,0
0805 = smd 0.8 x 1.2: 1 -0.9,0; 2 0.9,0
1206 = smd 1.6 x 1.8: 1 -1.4,0; 2 1.4,0
1210 = smd 1.2 x 2: 1 -1.6,0; 2 1.6,0
SOD123 = smd 1.397 x 1.397: + -1.651,0; - 1.651,0
SOT23 = smd 1 x 1.4: 1 -0.95,-1.1; 2 0.95,-1.1; 3 0,1.1
DO-214AB = smd 2.286 x 4.8: 1 -3.1,0; 2 3.1,0
SMADIODE = smd 2.54 x 2.54: A 2.349,0; C -2.349,0
FIDUCIAL-1X2 = smd 1 x 1: 1 0,0
1X02_LOCK_LONGPADS = drill 1.016 long: 1 -0.127,0; 2 2.667,0
2X3 = drill 1.016 pad 1.88 octagon: 1 0,0; 2 0,2.54; 3 2.54,0; 4 2.54,2.54; 5 5.08,0; 6 5.08,2.54
FTDI_DEVICE_SIDE = drill 1.016 pad 1.88 square: P$1 -6.35,0 | drill 1.016 pad 1.88: P$2 -3.81,0; P$3 -1.27,0; P$4 1.27,0; P$5 3.81,0; P$6 6.35,0
OLED_LCD = drill 1.016 pad 2.032 square: 1 -7.42,13.7 | drill 1.016 pad 2.032: 2 -4.88,13.7; 3 -2.34,13.7; 4 0.2,13.7; 5 2.74,13.7; 6 5.28,13.7; 7 7.82,13.7 | drill 2.2 pad 3.6: M1 -11.34,13.04; M2 11.86,13.04; M3 11.86,-10.66; M4 -11.34,-10.66
G6K-RF = smd 0.8 x 1.8: 1 -3.8,-3.5; 2 -0.6,-3.5; 3 1.6,-3.5; 4 3.8,-3.5; 5 3.8,3.5; 6 1.6,3.5; 7 -0.6,3.5; 8 -3.8,3.5 | smd 2.5 x 2.5: A -5.75,-1.75; B 5.75,1.75
NR4018T100M = smd 1.25 x 3.8: 1 -1.4,0; 2 1.4,0
WE-LHMI = smd 4.1 x 3.5: 1 -4.75,0; 2 4.75,0
LED3MM = drill 0.813 pad 1.88: A -1.27,0; K 1.27,0
LED5MM = drill 0.813 pad 1.88: A -1.27,0; K 1.27,0
SMD4 = smd 1.78 x 2: 1 -1.27,-3.725; 2 1.27,-3.725; 3 1.27,3.725; 4 -1.27,3.725
1812L = smd 1.8 x 3.7: 1 -2.6,0; 2 2.65,0
SOT323 = smd 0.7 x 0.7: 1 -0.65,-0.925; 2 0.65,-0.925; 3 0,0.925
R2512 = smd 1.8 x 3.2: 1 -2.8,0; 2 2.8,0
ROTARY_ENC_PLAIN = drill 1.016 pad 2: A 7.493,-2.54; B 7.493,2.54; C 7.493,0; SW+ -6.985,2.54; SW- -6.985,-2.54 | drill 2.286 pad 4: P$3 0,6.604; P$4 0,-6.604
TAC_SW_SMD_KSC931G = smd 3.1 x 1: 1 -4.5,2; 2 4.5,2; 3 -4.5,-2; 4 4.5,-2
1X01_POGOPIN_HOLE_LARGE = drill 0.75 pad 1.5: 1 0,0
1X01NS-KIT = drill 1.016 pad 1.88: 1 0,0
TQFP32-08 = smd 1.27 x 0.559: 1 -4.293,2.8; 2 -4.293,2; 3 -4.293,1.2; 4 -4.293,0.4; 5 -4.293,-0.4; 6 -4.293,-1.2; 7 -4.293,-2; 8 -4.293,-2.8; 17 4.293,-2.8; 18 4.293,-2; 19 4.293,-1.2; 20 4.293,-0.4; 21 4.293,0.4; 22 4.293,1.2; 23 4.293,2; 24 4.293,2.8 | smd 0.559 x 1.27: 9 -2.8,-4.293; 10 -2,-4.293; 11 -1.2,-4.293; 12 -0.4,-4.293; 13 0.4,-4.293; 14 1.2,-4.293; 15 2,-4.293; 16 2.8,-4.293; 25 2.8,4.293; 26 2,4.293; 27 1.2,4.293; 28 0.4,4.293; 29 -0.4,4.293; 30 -1.2,4.293; 31 -2,4.293; 32 -2.8,4.293
SSOP6 = smd 0.8 x 0.45: 1 -1.275,0.95; 2 -1.275,0; 3 -1.275,-0.95; 4 1.275,-0.95; 5 1.275,0; 6 1.275,0.95
TSSOP14 = smd 0.35 x 0.9: 1 -1.95,-2.925; 2 -1.3,-2.925; 3 -0.65,-2.925; 4 0,-2.925; 5 0.65,-2.925; 6 1.3,-2.925; 7 1.95,-2.925; 8 1.95,2.925; 9 1.3,2.925; 10 0.65,2.925; 11 0,2.925; 12 -0.65,2.925; 13 -1.3,2.925; 14 -1.95,2.925
SOT95P280X145-5N = smd 1.321 x 0.559: 1 -1.27,0.94; 2 -1.27,0; 3 -1.27,-0.94; 4 1.27,-0.94; 5 1.27,0.94
SOT23-3 = smd 0.8 x 0.9: 1 -0.95,-1; 2 0.95,-1; 3 0,1.1
SO16 = smd 0.6 x 1.2: 1 -4.445,-2.8; 2 -3.175,-2.8; 3 -1.905,-2.8; 4 -0.635,-2.8; 5 0.635,-2.8; 6 1.905,-2.8; 7 3.175,-2.8; 8 4.445,-2.8; 9 4.445,2.8; 10 3.175,2.8; 11 1.905,2.8; 12 0.635,2.8; 13 -0.635,2.8; 14 -1.905,2.8; 15 -3.175,2.8; 16 -4.445,2.8
SOIC8 = smd 2.15 x 0.5: 1 -2.875,1.905; 2 -2.875,0.635; 3 -2.875,-0.635; 4 -2.875,-1.905; 5 2.875,-1.905; 6 2.875,-0.635; 7 2.875,0.635; 8 2.875,1.905 | smd 2.4 x 3.1: PAD 0,0
RESONATOR-SMD = smd 0.7 x 1.7: 1 -1.2,0; 2 0,0; 3 1.2,0

### Placement (x,y rotation side)
BZ1  47.14,34.37 90 top
C1  94.13,41.68 0 bottom
C2  2.03,26.49 90 top
C3  78.96,43.93 0 top
C4  86.65,46.9 270 top
C5  73.7,39.79 180 top
C6  84.29,40.88 0 top
C7  54.1,23.15 180 top
C8  53.14,26.49 90 top
C9  56.06,38.04 90 top
C10  5.38,34.86 270 top
C11  55.77,30.99 90 top
C12  93.98,21.16 90 top
C13  26.06,14.43 0 top
C14  65.34,27.89 0 top
C15  86.61,46.56 90 bottom
C16  83.57,16.54 90 bottom
C17  3.48,39.65 270 top
C18  6.64,39.6 270 top
C19  20.32,34.67 0 top
C20  62.23,34.37 90 bottom
C21  2.49,34.63 270 top
C22  81.79,13.29 90 bottom
C23  81.79,16.59 90 bottom
C24  93.98,9.73 90 top
C25  40.89,45.29 0 top
C26  40.89,42.5 180 top
C27  77.94,30.57 270 bottom
C28  8.97,38.51 90 top
C29  12.13,42.78 0 top
C30  10.93,35.96 90 bottom
C31  84.98,28.96 0 bottom
C32  87.01,30.74 0 bottom
C33  90.39,35.55 270 top
C34  22.94,35.49 270 top
C35  5.59,25.22 0 top
C36  7.87,15.83 0 top
C37  21.48,38.38 270 top
C38  19.44,38.44 270 top
C39  31.71,36.11 90 bottom
C40  28.66,36.11 90 bottom
C41  34.72,36.16 90 bottom
C42  25.74,36.11 90 bottom
C43  38.62,39.66 0 top
C44  29.84,25.01 90 top
C45  78.74,30.71 0 top
C46  90.42,25.22 90 top
C47  74.3,37.29 0 top
C48  73.58,23.01 180 top
C49  68.71,32.21 270 top
C50  71.63,44.53 0 bottom
C51  21.59,28.78 270 bottom
C52  23.62,28.78 90 bottom
C53  72.26,32.72 0 bottom
C54  65.28,36.91 180 top
D1  84.29,43.17 180 top
D2  24.6,17.27 180 bottom
D3  14.99,30.05 180 bottom
D5  4.97,20.73 180 top
D6  18.59,45.48 0 top
D8  18.92,17.06 180 top
FID1  89.37,49.84 0 top
FID2  95,1.09 0 top
FID3  8.13,51.39 0 bottom
FID4  8.89,51.39 0 top
FID5  88.86,49.84 0 bottom
FID6  95,4.9 0 bottom
J1  9.56,13.08 0 top
J2  17.81,13.12 0 top
J3  69.09,47.58 0 top
J4  94.23,33.1 90 top
J5  76.96,7.44 90 top
J6  47.05,34.44 0 top
K1  16.76,22.43 270 bottom
L1  83.15,46.78 90 top
L2  28.87,41.98 90 top
L3  76.71,3 270 top
L4  79.76,7.14 270 top
L5  30.35,22.3 0 top
L6  29.97,27.89 0 top
L7  47.4,26.6 90 top
LED1  63.41,47.65 0 top
LED2  41.55,23.7 0 top
LED3  65.84,23.7 0 top
OP1  83.84,3.13 270 top
PTC1  11.98,19.24 270 top
Q1  45.92,23.4 180 top
Q2  64.08,43.26 0 top
Q3  9.65,24.97 180 top
Q9  81.67,29.47 180 bottom
R1  38.1,33.86 180 top
R2  74.3,35.77 0 top
R3  22.42,31.05 90 top
R4  24.19,31.05 90 top
R5  25.97,31.05 90 top
R6  27.75,31.05 90 top
R7  31.31,31.05 90 top
R8  29.53,31.05 90 top
R9  20.49,31.04 90 top
R10  18.63,31.04 90 top
R11  20.35,36.22 0 top
R12  34.42,30.67 270 top
R13  2.43,29.97 270 top
R14  44.7,45.04 90 top
R15  73.7,41.57 0 top
R16  76.16,41.9 90 top
R17  47.24,45.04 90 top
R18  59.36,37.78 180 top
R19  88.62,11.24 180 bottom
R20  73.53,25.35 180 top
R21  49.78,45.04 90 top
R22  78.99,4.52 180 bottom
R23  55.77,34.04 270 top
R24  52.32,45.04 90 top
R25  68.71,28.91 90 top
R26  79.03,2.19 180 bottom
R27  90.81,22.56 0 top
R28  81.93,32.01 0 bottom
R29  54.86,45.04 90 top
R30  79.76,23.45 180 top
R31  61.67,42.66 90 top
R32  78.69,33.45 180 top
R33  64.77,29.66 0 top
R34  49.28,22.81 180 top
R35  59.65,42.72 90 top
R36  26.06,12.65 180 top
R37  26.06,16.21 0 top
R38  42.47,28.48 180 top
R39  66.12,34.25 270 top
R40  70.51,22.99 180 top
R43  8.97,35.87 90 bottom
R44  20.64,41.23 0 top
R52  76.2,17.1 90 top
R53  76.96,24.46 90 top
R54  90.93,6.94 180 top
R57  79.9,36.58 90 top
R58  87.01,32.26 0 bottom
R61  79.54,29.68 90 bottom
R65  15.32,34.25 180 top
R66  56.39,45.04 90 top
R77  78.12,36.58 90 top
R99  88.65,13.67 0 bottom
S1  86,15.32 180 top
S2  10.67,30.3 180 top
TP1  22.96,13.96 0 top
TP2  49.83,25.45 0 top
TP3  28.07,18.11 0 top
TP4  64.14,39.83 0 top
TP5  94.49,15.32 0 top
TP6  31.75,26.24 0 top
TP7  31.75,24.08 0 top
TP8  15.37,25.22 0 top
TP9  62.1,27.76 0 top
TP10  66.8,39.83 0 top
TP11  15.49,21.29 0 top
TP12  22.48,12.14 0 top
TP13  94.23,24.21 0 top
TP14  19.15,51.13 0 top
U1  85.99,30.23 0 top
U2  78.96,41.39 0 top
U3  73.03,30.43 0 top
U4  MAX9938FEUK+T  [SOT95P280X145-5N]  36.65,36.7 0 top
U5  55.88,26.75 270 top
U6  60.96,33.35 270 top
U7  23.05,24.96 180 top
U8  14.24,38.75 0 top
X1  78.75,28.01 90 top

### Tracks (layer width: path | path; a pad name or v marks a point on that pad's centre or on a via)
AREF  (via drill 0.3 pad 0.64)
  Top 0.305: U1.20 87.28,29.83 v87.12,29.67
  Bottom 0.305: v87.12,29.67 86.74,29.67 86.61,29.8 86.61,30.23 C32.2
BUZZ  (via drill 0.41 pad 0.81)
  Top 0.406: U1.10 83.99,29.71 84.33,30.05 v84.33,31.07
  Bottom 0.406: v84.33,31.07 84.33,31.32 83.64,32.01 R28.1
CHG_POL
  Top 0.406: R30.1 83.57,23.45 84.79,24.67 U1.11
CS
  Top 0.406: J6.7
  Top 0.61: J6.7 R29.2 R66.2
D0
  Top 0.406: J6.3
  Top 0.61: R14.2 J6.3
D1
  Top 0.406: J6.4
  Top 0.61: R17.2 J6.4
DSP_RST  (via drill 0.3 pad 0.64)
  Top 0.406: U1.12 85.59,26.75 85.09,27.26 85.09,29.41 85.72,30.05 85.72,32.61 84.99,33.35 v84.84,33.35 | R21.1 49.78,40.46 v52.58,37.67
  Bottom 0.406: v52.58,37.67 53.85,36.4 65.02,36.4 66.65,34.77 72.95,34.77 73.36,35.18 83.01,35.18 v84.84,33.35
DTR
  Top 0.406: C33.2 91.16,34.65 91.44,34.37 91.44,31.57 92.46,30.56 92.46,28.53 J4.P$1
EN_DCDC  (via drill 0.3 pad 0.64)
  Top 0.406: U8.3 10.22,38.11 v9.91,38.43 | R31.1 61.67,40.77 v61.72,40.72 | U1.24 89.38,33.03 v88.9,33.3
  Bottom 0.406: R43.2 8.97,38 9.4,38.43 v9.91,38.43 9.91,40.72 11.43,42.24 61.21,42.24 61.72,41.73 v61.72,40.72 61.67,40.77 R31.1 62.15,42.24 65.53,42.24 65.79,41.99 67.56,41.99 68.83,40.72 76.45,40.72 77.98,42.24 82.04,42.24 82.8,41.48 87.73,41.48 89.31,39.91 89.31,33.76 v88.9,33.3
GND  (via drill 0.3 pad 0.61, 0.3 pad 0.64, 0.41 pad 0.81, 0.41 pad 0.91)
  Top 0.305: 3.53,38 C17.2 | 6.64,36.18 v6.6,36.15 | 19.4,39.38 C38.1 19.43,39.36 | 14.87,39.38 U8.PAD | U1.3 82.57,31.43 v83.31,30.68 82.45,29.83 U1.5 | 85.98,43.21 D1.+ | 35.38,38.74 v35.31,38.81 | 57.48,30.39 v57.4,30.3 58.03,30.93 U6.7 | 54.49,39.44 v54.48,39.45 | 78.58,41.39 v78.61,41.35 | 8.91,37.67 C28.1
  Top 0.406: C21.2 1.08,33.03 v0.89,32.84 | 85.69,42.92 D1.+ | 86.61,45.47 C4.2 | X1.2 | C45.1 77.27,30.71 v76.83,31.14 76.96,31.27 76.96,31.73 77.79,32.55 R32.2 | U3.7 75.95,27.51 v77.09,26.37 | 44.59,24.32 v44.3,24.61 | R34.1 50.8,22.81 51.18,23.19 51.18,24.21 51.74,24.77 v51.74,25.58
  Top 0.61: Q3.2 9,25.46 8.76,25.22 C35.2 6.99,26.74 v6.86,26.88 6.17,27.57 S2.2 | C2.1 2.03,24.72 v1.78,24.46 | C18.2 3.53,38 | C10.1 6.22,35.76 v6.6,36.15 | C18.2 6.64,36.18 | 19.4,39.38 U8.7 14.87,39.38 | 19.43,39.36 19.43,40.08 19.74,40.39 R44.1 19.74,42.77 v19.3,43.21 | D6.1 13.83,45.48 v13.64,45.29 | C34.1 24.07,36.39 v24.21,36.53 | U1.21 88.96,30.63 v88.9,30.68 | C4.2 87.97,45.5 v88.14,45.67 | C12.1 95.01,20.26 v95.12,20.14 | C24.1 95.01,8.83 v95.12,8.71 | TP1.1 23.51,14.43 C13.1 R36.2 24.26,12.65 v24,12.4 | D8.A 16.57,18.68 v16,19.26 | U7.10 U7.9 17.8,22.16 17.53,22.43 v17.53,23.06 | v18.54,26.37 18.61,26.43 U7.8 U7.7 | C44.1 27.97,24.11 v27.56,23.7 27.5,23.64 U7.16 | U4.2 U4.1 35.38,38.74 | C26.2 39.49,43.76 39.99,44.26 C25.1 39.99,47.78 J6.1 | C7.1 55.8,23.15 v56.01,22.94 | U5.3 57.79,26.75 v58.04,27 | C11.1 57.19,30.09 v57.4,30.3 | C49.1 67.58,33.11 67.31,32.84 v67.31,32.41 | C47.1 v72.26,37.29 | C54.1 v67.31,36.91 | C9.2 54.49,39.44 | R16.2 75.14,42.8 v75.06,42.88 | U2.2 78.58,41.39 | X1.2 79.74,28 v80.14,27.64 | C46.1 89.52,24.32 v89.28,24.08 | C18.2 7.8,38 8.13,37.67 8.91,37.67 | Q2.2 66.46,42.33 v67.06,43 | R18.1 60.26,34.56 v59.94,34.24 | C6.2 85.69,42.92 | 85.98,43.21 85.98,44.15 86.61,44.78 86.61,45.47 | C8.1 51.75,25.59 v51.74,25.58 | 85.83,1.86 v85.7,1.73 | C14.1 64.44,26.5 v64.36,26.42 | C48.1 75.21,23.01 v75.44,22.79 | Q1.2 44.59,24.32 | v6.99,17.1 6.99,15.84 C36.1
  Top 0.813: OP1.3 85.83,1.86
  Bottom 0.305: C30.1 10.85,34.97 R43.1 8.97,34.09 v9.14,33.91 | C42.2 C40.2 C39.2 | 34.67,37.71 C41.2 34.67,37.81 | 88.85,30.74 v88.9,30.68 | Q9.2 83.02,30.39 v83.31,30.68 | 23.36,29.92 C52.2
  Bottom 0.406: K1.2 20.26,23.25 | 88.13,45.66 v88.14,45.67 | C27.1 77.16,31.47 v76.83,31.14 | C1.1 95.03,42.54 v94.56,43 | 81.84,15.64 C23.1
  Bottom 0.61: 34.67,37.71 C39.2 31.71,38.6 v31.5,38.81 | K1.5 15.38,18.63 v16,19.26 | v35.31,38.81 34.92,38.81 34.67,38.56 34.67,37.81 | C50.1 v73.41,44.53 | C53.1 73.76,32.72 v74.3,32.18 | C31.1 85.88,27.74 v85.98,27.64 | C32.1 88.85,30.74 | 23.36,29.92 22.61,29.92 22.36,29.68 C51.1 21.59,30.56 19.94,32.21 v19.94,32.97 | C22.1 82.92,12.39 v83.06,12.52 | C23.1 80.76,15.69 v80.64,15.57 | D2.1 23.65,19.92 v23.62,19.89 | 20.26,23.25 19.81,23.7 v18.67,23.7 | C20.1 60.72,33.47 v59.94,34.24 | C15.1 88.13,45.66 | C16.1 81.84,15.64 | K1.3 22.28,20.83 22.61,20.5 22.61,17.35 20.47,15.22 J2.2
  Bottom 0.813: R22.2 82.73,4.52 v83.06,4.19
  other vias: 15.11,39.96 14.35,39.96 13.59,39.96 13.34,39.19 14.1,39.19 14.86,39.19 15.11,38.43 14.35,38.43 13.59,38.43 13.34,37.67 14.1,37.67 14.86,37.67
  pour GND (isolate 0.305): 0,11 0,44.91 0,45.04 8,53.04 87.88,53.04 96.01,44.91 96.01,-0.05 74.8,-0.05 74.8,21.03 29.34,21.03 29.34,11
  pour Bottom: 12.04,41.58 12.04,37.52 12.9,36.65 12.9,35.38 13.67,34.62 15.95,34.62 17.58,36.25 18.44,37.11 18.44,40.16 18.64,40.36 18.85,40.57 18.85,41.28 18.54,41.58
  pour Top (no thermals): 86.36,2.87 86.36,0.84 90.17,0.84 90.17,2.87
ISENSE  (via drill 0.3 pad 0.64, 0.41 pad 0.91, 1 pad 1.93)
  Top 0.406: U6.13 63.33,34.65 63.09,34.42 62.74,34.42 62.48,34.67 62.48,36.15 63.5,37.16 63.5,39.19 TP4.1 65.38,38.58 67.72,38.58 68.58,39.45 68.58,42.88 66.55,44.91 66.55,50.24 68.2,51.89 75.82,51.89 76.71,51.01 v76.71,47.58 v76.71,44.02 | U4.3 33.91,35.77 v33.78,35.89 | U1.22 89.05,31.43 v88.9,31.57
  Bottom 0.406: v33.78,35.89 36.32,35.89 36.83,36.4 36.83,40.46 37.85,41.48 54.86,41.48 57.4,39.04 63.5,39.04 TP4.1 | v88.9,31.57 89.56,31.57 90.02,32.18 90.02,40.11 87.88,42.24 83.06,42.24 82.3,43 77.6,43 v76.71,44.02
MISO  (via drill 0.3 pad 0.64, 0.41 pad 0.91)
  Top 0.406: R24.1 53.22,44.14 v53.59,43.77 | U1.16 88.79,26.73 v88.14,27.51
  Top 0.61: v68.45,44.4 68.45,46.56 J3.1
  Bottom 0.406: v53.59,43.77 65.28,43.77 J3.1 | v88.14,27.51 88.14,27.76 88.65,28.27 90.42,28.27 90.93,28.78 90.93,32.08 90.63,32.49 90.63,40.36 87.73,43.26 83.06,43.26 82.17,44.27 81.66,44.91 74.93,44.91 74.42,44.27 72.64,42.24 69.85,42.24 68.58,43.51 v68.45,44.4
MOSI  (via drill 0.3 pad 0.64, 0.41 pad 0.81)
  Top 0.406: R17.1 48.4,44.14 v48.51,44.02 | U1.15 87.99,24.86 v88.01,24.59
  Bottom 0.406: v48.51,44.02 48.77,43.77 52.07,43.77 52.83,44.53 64.77,44.53 67.31,47.07 67.31,50.62 68.33,51.64 70.87,51.64 71.63,50.88 | 71.63,50.88 J3.4 | v88.01,24.59 88.27,24.84 89.92,26.75 91.03,26.75 92.46,28.17 92.46,32.59 91.95,33.1 91.95,40.97 88.14,44.78 83.82,44.78 76.96,51.64 72.39,51.64 71.63,50.88
N$1
  Top 0.406: U7.6 21.14,29.1 22.2,30.15 R3.1 22.35,30.09
N$2
  Top 0.406: U7.5 22.42,28.49 24.02,30.09 24.13,30.09 R4.1
N$3
  Top 0.406: U7.4 23.69,28.59 24.13,29.03 24.7,29.03 25.82,30.15 R5.1
N$4
  Top 0.406: U7.3 24.96,28.34 25.65,29.03 26.63,29.03 R6.1
N$5  (via drill 0.3 pad 0.64)
  Top 0.406: R7.1 31.3,29.48 v31.5,29.29 | U7.14 24.96,21.1 25.65,20.4 27.18,20.4 v27.43,20.14
  Bottom 0.406: v31.5,29.29 29.72,27.51 29.72,23.19 27.43,20.91 v27.43,20.14
N$6
  Top 0.406: J6.6
  Top 0.61: R24.2 J6.6
N$7  (via drill 0.3 pad 0.64)
  Top 0.406: R8.1 29.53,29.61 v29.21,29.29 | U7.13 23.69,21.1 25.15,19.64 v26.67,19.64
  Bottom 0.406: v29.21,29.29 29.21,28.53 28.96,28.27 28.96,23.45 26.67,21.16 v26.67,19.64
N$8
  Top 0.406: U7.12 22.42,24.4 21.34,25.48 18.03,25.48 17.53,25.99 17.53,28.53 18.03,29.03 20.07,29.03 20.48,29.45 R9.1
N$9
  Top 0.406: U7.11 21.14,24.4 20.83,24.72 17.78,24.72 16,26.49 13.46,26.49 12.7,27.26 12.7,29.29 13.46,30.05 18.54,30.05 R10.1
N$10
  Top 0.406: U4.4 38.73,35.77 | R1.1 39,35.5 38.73,35.77 | C43.2 40.02,37.05 38.73,35.77
N$11
  Top 0.61: R35.2 59.65,44.49 60.2,45.04 61.47,45.04 61.98,45.54 61.98,47.49 LED1.A
N$12
  Top 0.61: Q2.3 64.08,47.05 LED1.K
N$13
  Top 0.406: U6.6 58.7,32.05 59.18,31.57 59.18,28.78 61.47,26.49 62.99,26.49 63.46,26.97 63.46,29.25 R33.1
N$14
  Top 1.016: PTC1.1 10.03,21.84 8.94,20.75 8.09,20.75 D5.1
N$15
  Top 0.406: U6.12 64.96,34 65.33,34.37 65.79,34.37 66.12,34.7 R39.1
N$16
  Top 0.406: C3.1 78.06,43.08 77.68,42.71 U2.1
N$17
  Top 0.406: 6.1,32.23 S2.4 6.35,32.49
  Top 0.61: R13.1 5.65,30.87 6.1,31.32 6.1,32.23 | C10.2 5.99,33.96 6.35,33.61 6.35,32.49 | S2.4 10.64,32.3 12.59,34.25 R65.2
N$18
  Top 0.406: U3.9 74.33,35.29 74.8,35.77 R2.2 C47.2
N$19
  Top 0.406: C3.2 79.86,43.16 80.23,42.78 U2.6 81.12,42.34 81.95,43.17 D1.- 82.64,44.11 83.15,44.62 L1.1
N$20  (via drill 0.3 pad 0.61)
  Top 0.406: v78.94,32.28 78.94,32.81 R32.1
  Bottom 0.305: v78.94,32.28 78.94,32.39 79.3,32.74 80.26,32.74 80.37,32.64 80.39,32.64 R28.2
  Bottom 0.406: Q9.1 R28.2
N$21
  Top 0.61: R31.2 62.69,43.56 63.43,42.82 Q2.1
N$22
  Top 0.406: U3.10 73.67,34.86 73.41,35.13 73.41,35.75 R2.1
N$23
  Top 0.406: U3.6 74.33,25.46 R20.1
N$24
  Top 0.406: X1.1 81.08,26.8 U1.8
N$25
  Top 0.406: U3.2 71.72,28.33 71.37,28.68 70.1,28.68 69.44,28.02 R25.1
N$26
  Top 0.406: R25.2 C49.2 71.37,31.32 71.72,31.67 U3.13
N$27
  Top 0.406: R15.2 C5.1 75.78,39.79 76.16,40.17 | R16.1 76.16,40.17 | U2.3 77.68,39.91 77.47,39.7 76.63,39.7 76.16,40.17
N$28
  Top 0.406: U3.3 72.38,26.26 72.64,25.99 72.64,25.36 R20.2 72.68,25.3 C48.2
N$29
  Top 0.406: C11.2 R23.2 55.77,33.75 56.02,34 U6.3
N$30  (via drill 0.41 pad 0.81)
  Top 0.406: U1.13 v86.39,24.68 | v88.9,22.56 R27.1
  Bottom 0.254: 86.23,24.72 86.49,24.84 v88.9,22.56
  Bottom 0.406: v86.39,24.68 86.39,24.81 86.23,24.72
N$31  (via drill 0.41 pad 0.91)
  Top 0.813: OP1.4 87.57,5.91 v88.7,7.04
  Bottom 0.406: R19.1 87.72,10.86 87.73,10.85 87.73,10.54 88.7,9.58 v88.7,7.04
  Bottom 0.61: R19.1 87.72,11.84 R99.1
  Bottom 0.813: R99.1 90.6,13.67 92.25,15.32 TP5.1
  pour Top (no thermals): 86.36,5.41 86.36,3.38 90.17,3.38 90.17,5.41
N$32  (via drill 0.41 pad 0.81)
  Top 0.406: 47.4,29.61 BZ1.1
  Top 0.61: L7.2 47.4,29.61 | BZ1.1 47.14,31.52 v47.55,31.93
  Bottom 0.406: 79.24,30.28 R61.2 79.55,30.57 79.55,29.95 79.28,29.67 C27.2 77.76,29.49 75.39,29.49 73.3,31.57 58.67,31.57 58.22,32.03 47.65,32.03 v47.55,31.93
N$33
  Top 0.406: PTC1.2
  Top 0.813: C36.2 8.77,16.22 9.14,16.59 PTC1.2
  Top 1.016: PTC1.2 12.23,16.51 J1.2
N$34
  Top 0.406: U6.2 56.81,34.65 56.59,34.88 55.83,34.88 R23.1
N$36
  Top 0.406: U1.7 80.82,28.23 79.84,29.2 X1.3
N$37
  Top 0.406: U6.9 64.7,32.05 65.23,31.52 65.23,30.91 65.63,30.51 65.63,29.69 R33.2 65.67,29.05 66.04,28.68 66.04,28.09 C14.2
N$38
  Top 0.61: LED2.A 40.28,25.07 41.57,26.36 R38.2
N$39
  Top 0.406: R39.2 66.55,33.35 67.31,34.11 67.31,35.38 68.33,36.4 68.33,37.42 67.82,37.92 64.77,37.92 64.38,37.53 C54.2 | U6.11 R39.2 | R39.2
N$40  (via drill 0.3 pad 0.64)
  Top 0.406: U7.2 26.23,26.68 v26.42,26.49 | L6.1 29.07,28.16 v28.19,29.03
  Bottom 0.406: v28.19,29.03 26.42,29.03 25.91,28.53 25.91,27 v26.42,26.49
N$41  (via drill 0.41 pad 0.91)
  Top 0.406: 82.09,1.86 v82.35,2.11
  Top 0.813: OP1.2 82.09,1.86
  Bottom 0.406: v82.35,2.11 80.71,2.11 R26.2
  pour Top (no thermals): 77.98,2.87 77.98,0.84 81.28,0.84 81.28,1.35 81.28,2.87
N$42  (via drill 0.3 pad 0.64, 0.41 pad 0.91, 0.6 pad 1.02)
  Top 0.406: v68.48,22.68 67.31,21.52 39.06,21.52 38.2,22.38 38.2,24.82 40.44,27.05 40.44,29.49 v40.39,29.54 | R30.2 78.86,24.2 79.63,24.97 80.09,24.97 v80.11,24.95
  Top 0.61: Q3.1 11.34,25.89 v11.43,25.99
  PWR 0.406: v68.48,22.68 68.68,22.89 68.68,23.8 69.14,24.26 79.43,24.26 v80.11,24.95
  Bottom 0.406: v11.43,25.99 11.43,31.32 13.72,33.61 19.05,33.61 19.3,33.86 20.32,33.86 22.3,31.88 31.95,31.88 33.78,30.05 39.88,30.05 v40.39,29.54
N$43  (via drill 0.41 pad 0.91)
  Top 0.406: L3.2 75.45,2.1 v75.54,2.11
  Bottom 0.406: v75.54,2.11 77.76,2.11 R26.1
N$44  (via drill 0.3 pad 0.64)
  Top 0.406: U8.4 11.36,36.47 v11.94,35.89
  Bottom 0.406: v11.94,35.89 11.9,35.89 C30.2
N$46  (via drill 0.3 pad 0.64)
  Top 0.406: v76.2,5.67 76.57,6.04 78.55,6.04 78.75,6.24 L4.2
  Bottom 0.406: v76.2,5.67 76.2,4.9 76.58,4.52 R22.1
N$47
  Top 0.406: 11.23,40.78 U8.1
  Top 0.61: C29.1 11.23,40.78
N$48
  Top 0.406: 19.45,34.7 C19.1 19.37,34.62 18.8,34.62 18.63,34.46 R10.2 R9.2 22.4,31.94 R3.2 R4.2 R5.2 R6.2 R8.2 R7.2 | R11.1 17.45,36.22 17.11,36.56 U8.5
  Top 0.61: R11.1 19.45,34.7
N$49
  Top 0.61: R40.2 69.61,24.09 68.28,25.43 66.29,25.43 LED3.A
N$51
  Top 0.61: U8.8 17.11,41.13 16.76,41.48 | 16.76,41.48 13.46,41.48 13.03,41.91 C29.2 | D6.2 18.73,45.48 17.78,44.53 17.78,42.5 16.76,41.48
  Top 1.016: D6.2 23.69,45.48 28.87,40.3 L2.1
N$52
  Top 0.406: 19.51,37.48 C38.2
  Top 0.61: C37.2 19.51,37.48 | U8.6 18.87,38.11 C38.2
N$53
  Top 0.61: R44.2 21.54,39.34 C37.1
N$54
  Top 0.406: U7.15 26.23,21.35 26.54,21.03 28.07,21.03 28.45,21.41 28.45,21.92 28.83,22.3 L5.1
N$55
  Top 0.406: L3.1 75.88,3.9 75.44,4.34 75.44,6.68
  Top 0.61: 75.44,6.68 75.95,7.19 76.83,7.19 J5.1
N$56
  Top 0.813: L4.1 79.76,9.27 78.92,10.11 J5.2
N$57
  Top 0.406: Q1.3 44.05,22.47 LED2.K
  Bottom 0.406: LED3.K 67.11,22.02 66.55,21.46 45.06,21.46 LED2.K
N$64  (via drill 0.41 pad 0.81)
  Top 0.61: v50.6,31.12 50.19,31.12 49.17,32.13 49.17,34.57 47.14,36.6 BZ1.2
  Bottom 0.406: Q9.3 80.76,28.54 80.52,28.78 R61.1 75.08,28.78 73.05,30.81 58.42,30.81 57.91,31.32 50.8,31.32 v50.6,31.12
OVC_ALARM  (via drill 0.41 pad 0.81)
  Top 0.406: TP10.1 65.41,41.23 63.5,41.23 62.79,40.52 62.79,37.36 61.82,36.4 61.82,33.71 62.83,32.7 U6.10 65.06,32.7 67.26,30.51 67.26,27.46 v67.46,27.05 | 83.09,25.83 U1.9 83.11,25.86 82.42,25.86 82.12,25.55 82.12,24.61 v81.99,24.49
  Bottom 0.406: v67.46,27.05 67.67,26.85 70.92,26.85 71.32,26.44 75.79,26.44 78.38,23.85 81.36,23.85 v81.99,24.49
PEDAL_IP  (via drill 0.3 pad 0.64)
  Top 0.406: U6.4 59.94,33.35 v60.96,32.34 | U1.32 82.65,34.52 v82.5,34.37
  Bottom 0.406: v82.5,34.37 73.56,34.37 73.15,33.96 65.23,33.96 63.8,32.54 61.16,32.54 v60.96,32.34
PUSH  (via drill 0.3 pad 0.64, 0.41 pad 0.81)
  Top 0.406: TP9.1 60.2,29.67 60.2,31.83 v59.44,32.59 59.32,32.7 U6.5 | R65.1 17.16,34.25 v17.53,34.62
  Bottom 0.406: v59.44,32.59 59.32,32.7 56.47,32.7 51.76,37.42 46.23,37.42 39.62,30.81 34.04,30.81 32.21,32.64 22.81,32.64 20.83,34.62 v17.53,34.62
PUSH_FILT  (via drill 0.3 pad 0.64, 0.41 pad 0.81)
  Top 0.406: U1.25 88.79,37.12 v88.44,37.47 | U6.8 62.3,31.4 61.77,31.93 61.77,32.74 61.21,33.3 61.21,37.16 61.98,37.92 v61.98,39.8
  Bottom 0.406: v61.98,39.8 63.4,41.23 67.31,41.23 68.58,39.96 82.91,39.96 83.67,40.72 87.58,40.72 88.65,39.65 88.65,37.67 v88.44,37.47
RESET
  Top 0.406: 75.69,38.43 70.61,38.43 69.34,39.7 69.34,44.02 70.87,45.54 73.41,45.54 74.17,46.31 J3.5 | 75.69,38.43 76.2,38.94 79.76,38.94 80.26,39.45 83.95,39.45 85.6,37.8 | C33.1 90.39,36.95 88.9,38.43 86.23,38.43 85.6,37.8 | U1.29 85.6,37.8 | R77.1 76.67,35.68 76.2,36.15 76.2,36.81 76.1,36.91 76.1,38.03 75.69,38.43
ROTA
  Top 0.406: 78.49,17.88 S1.A | U3.5 73.67,26.38 73.53,26.24 73.53,24.59 73.79,24.34 75.06,24.34 75.82,23.57 76.95,23.57 R53.1
  Top 0.813: R53.1 76.96,19.99 78.49,18.47
  Top 1.016: 78.49,18.47 78.49,17.88
  Bottom 0.813: C23.2 78.88,17.49
  Bottom 1.016: 78.88,17.49 S1.A
ROTA_FILT  (via drill 0.41 pad 0.81)
  Top 0.406: U1.2 83.33,32.23 83.69,32.59 v83.69,33.1 | U3.4 73.03,28.09 75.69,30.76 v75.69,32.21
  Bottom 0.406: v75.69,32.21 76.45,33.35 83.44,33.35 v83.69,33.1
ROTB  (via drill 0.3 pad 0.64)
  Top 0.406: S1.B | U3.11 73.03,29.36
  Top 0.61: 73.03,29.36 v72.49,28.83
  Top 0.813: R52.1 76.2,14.05 77.47,12.78 | v85.85,14.05 81.05,14.05 79.78,12.78
  Top 1.016: 77.47,12.78 S1.B | 79.78,12.78 S1.B
  Bottom 0.406: 78.23,27.26 79.5,25.99 81.94,25.99 83.26,24.66
  Bottom 0.61: 83.26,24.66 83.26,21.01 85.6,18.67 85.6,14.3 v85.85,14.05 | 78.23,27.26 74.57,27.26 73,28.83 v72.49,28.83
  Bottom 0.813: C22.2 79.91,14.19 S1.B
ROTB_FILT
  Top 0.406: U1.1 81.7,33.7 80.77,34.62 75.44,34.62 74.98,34.16 U3.8
ROTPUSH  (via drill 0.3 pad 0.64)
  Top 0.406: U3.1 71.08,26.04
  Top 0.61: R54.1 91.83,9.87 92.59,10.63 C24.2 | v81.89,18.52 87.25,18.52 S1.SW+ | 71.08,26.04 v70.05,25.02
  Top 1.016: C24.2 93.98,11.79 S1.SW+
  Bottom 0.61: v70.05,25.02 70.61,24.46 75.13,24.46 81.08,18.52 v81.89,18.52
RPUSH_FILT  (via drill 0.3 pad 0.64)
  Top 0.406: U3.12 72.38,35.77 v71.98,36.2 | U1.26 87.99,35.58 87.68,35.89 v87.25,35.89
  Bottom 0.406: v87.25,35.89 87.25,35.26 86.87,34.88 85.85,34.88 84.33,36.4 72.19,36.4 v71.98,36.2
RST
  Top 0.406: J6.5
  Top 0.61: R21.2 J6.5
RX-I  (via drill 0.3 pad 0.64)
  Top 0.406: J4.P$3 93.47,31.83 92.84,32.46 92.84,37.03 89.92,39.96 87.38,39.96 v86.61,39.19 | v83.82,38.43 84.79,37.46 U1.30
  Bottom 0.406: v86.61,39.19 84.58,39.19 v83.82,38.43
SCK  (via drill 0.3 pad 0.64)
  Top 0.406: R14.1 44.7,43.51 v45.21,43 | U1.17 89.24,27.43 v89.15,27.51
  Bottom 0.406: v45.21,43 65.79,43 68.33,45.54 69.85,45.54 J3.3 73.28,45.67 81.92,45.67 83.57,44.02 87.88,44.02 91.29,40.62 91.29,32.74 91.69,32.34 91.69,28.42 90.78,27.51 v89.15,27.51
SCL  (via drill 0.3 pad 0.64)
  Top 0.406: L5.2 31.25,23.58 TP7.1 | 79.94,35.64 R57.1 80.96,35.68 81.48,36.2 v81.48,37.16 | U1.28 86.39,35.86 v86.36,35.89 | v39.37,31.83 39.37,27.51 v38.86,27
  Bottom 0.406: TP7.1 31.75,24.46 34.29,27 v38.86,27 | v39.37,31.83 45.97,38.43 55.63,38.43 56.24,37.82 68.28,37.82 69.09,38.64 80.06,38.64 81.48,37.21 v81.48,37.16 81.74,37.01 85.75,37.01 86.36,36.4 v86.36,35.89
SDA  (via drill 0.3 pad 0.64)
  Top 0.406: U1.27 87.19,33.42 v87.12,33.35 | L6.2 31.37,27.89 31.75,27.51 TP6.1 | v38.35,32.08 38.35,28.27 v37.85,27.76
  Bottom 0.406: R58.1 87.45,32.26 87.12,32.59 v87.12,33.35 87.68,33.35 88.09,33.76 88.09,36.2 86.67,37.62 82.3,37.62 80.67,39.25 68.68,39.25 67.87,38.43 56.9,38.43 54.61,40.72 46.99,40.72 v38.35,32.08 | TP6.1 32.51,26.24 34.04,27.76 v37.85,27.76
SPARE  (via drill 0.3 pad 0.64, 0.41 pad 0.81, 0.41 pad 0.91)
  Top 0.305: U6.1 58.03,36.07 57.51,36.6 56.09,36.6 C9.1
  Top 0.406: 56.07,36.65 C9.1 56.06,37.34 56.5,37.78 R18.2 | U6.1 58.96,35.3 v59.08,35.18 | U1.23 89.31,32.23 v88.9,32.44
  PWR 0.406: v86.87,15.95 86.87,16.84 83.36,20.35 83.36,27.41 81.79,28.98 81.79,35 84.58,37.8 | 84.58,37.8 84.58,40.97 83.44,42.11 73.15,42.11 69.6,38.56 69.57,38.56 68.94,37.92 64.01,37.92 61.21,35.13 59.13,35.13 v59.08,35.18 | v88.9,32.44 88.29,32.44 87.99,32.74 87.99,36.2 87.38,36.81 85.57,36.81 84.58,37.8
  Bottom 0.61: v86.87,15.95 86.87,14.54 R99.2
SS  (via drill 0.3 pad 0.61, 0.3 pad 0.64)
  Top 0.406: R29.1 54.86,41.73 53.59,40.46 53.59,37.92 v53.85,37.67 | U1.14 87.19,27.82 86.36,28.65 86.36,33.1 v86.08,33.38
  Bottom 0.406: v53.85,37.67 54.51,37.01 65.43,37.01 67.06,35.38 72.54,35.38 72.95,35.79 83.72,35.79 86.11,33.4 v86.08,33.38
TEST  (via drill 0.3 pad 0.64, 0.41 pad 0.81)
  Top 0.406: TP13.1 92.2,24.21 91.7,23.71 R27.2 91.7,20.61 90.42,19.33 79.05,19.33 v78.64,19.74 | Q1.1 46.57,23.76 47.14,23.19 48.38,23.19 | 48.38,23.19 R34.2 | 48.38,23.19 48.39,23.19 48.39,23.7 48.64,23.95 v49.25,23.95
  Bottom 0.406: v78.64,19.74 76.61,21.77 75.18,21.77 73.36,23.6 69.7,23.6 68.07,25.22 64.01,25.22 63.2,26.04 57.63,26.04 55.8,24.21 50.88,24.21 50.62,23.95 v49.25,23.95
TX-O  (via drill 0.3 pad 0.64, 0.41 pad 0.81)
  Top 0.406: J4.P$2 94.23,29.8 92.08,31.95 92.08,36.78 89.66,39.19 v87.88,39.19 | U1.31 83.99,37.04 82.8,38.23 v82.8,38.43
  Bottom 0.406: v87.88,39.19 87.88,39.45 87.38,39.96 83.97,39.96 82.8,38.79 v82.8,38.43
VCC  (via drill 0.41 pad 0.91, 0.89 pad 1.68)
  Top 0.305: 3.53,41.2 C17.1 3.46,41.23 | 8.99,39.38 C28.2 | 82.8,40.97 C6.1
  Top 0.61: 4.95,41.2 C18.1 8.43,39.41 C28.2 | 4.95,41.2 3.53,41.2 | v5.08,40.08 5.12,40.05 5.12,41.03 4.95,41.2 | U8.2 8.99,39.38 | C6.1 82.64,40.93 81.7,40.93 v81.53,41.1 80.88,40.44 U2.4 U2.5 | C21.1 1.18,36.23 0.76,36.65 0.76,40.72 1.27,41.23 3.46,41.23 | U5.2 56.06,25.8 v55.98,25.68 | C7.2 53.12,23.06 v52.07,23.06 | L7.1 47.4,24.97 v47.75,24.61
  Top 1.016: v4.45,18.54 4.45,19.97 3.66,20.75 3.45,20.75 | 3.45,20.75 1.89,20.75 D5.2 | C35.1 4.19,21.49 3.45,20.75
  pour PWR (isolate 0.305): 4.45,43.38 10.92,43.38 10.92,24.97 31.24,25.1 31.24,26.62 61.09,26.75 61.09,28.4 71.63,28.4 71.63,39.7 73.41,41.48 83.31,41.48 83.31,38.94 76.2,38.94 74.93,37.67 74.93,24.84 68.2,24.72 64.9,21.03 29.34,20.91 29.34,11 0,11 0,26.49 4.45,26.49
VCC-ISO  (via drill 0.41 pad 0.81, 0.41 pad 0.91)
  Top 0.305: 41.78,45.3 C25.2 | C26.1 | 2.41,29.06 R13.2 | 83.24,48.08 L1.2 | 58.42,40.72 v58.42,40.97 | 1.06,29.07 v1.02,29.03 | 27.76,25.91 v27.69,25.99
  Top 0.406: U6.14 63.58,35.3 v63.37,35.51 | U1.4 79.64,30.63 C45.2 79.64,31.51 v79.91,31.78 | U3.14 70.62,33.36
  Top 0.508: 70.62,33.36 v70.23,32.97
  Top 0.61: J6.2 42.17,46.95 41.78,46.56 41.78,45.3 | C25.2 41.79,44.26 42.29,43.77 C26.1 | U1.6 82.94,29.03 v83.13,28.91 | C2.2 2.03,28.02 2.41,28.4 2.41,29.06 | R54.2 90.03,8.09 v89.92,8.21 | C12.2 95.13,22.06 v95.25,22.18 | C46.2 91.32,26.12 v91.69,25.99 91.69,28.02 91.48,28.23 U1.18 | R52.2 v76.2,18.87 | R53.2 78.09,25.36 v78.23,25.22 | R57.2 R77.2 77.02,37.48 v76.96,37.42 | C4.1 85.56,48.3 85.34,48.08 83.24,48.08 | L1.2 83.15,49.77 v82.8,50.12 | C5.2 R15.1 72.8,42.85 72.39,43.26 v70.61,43.26 | R35.1 58.77,41.83 58.42,41.48 v58.42,40.97 | R66.1 v56.39,41.23 | R13.2 1.06,29.07 | C44.2 27.76,25.91 | U7.1 27.5,26.18 v27.69,25.99 | R40.1 71.41,22.09 v71.73,21.77 | R38.1 44.09,28.48 v44.3,28.68
  Bottom 0.305: 84.03,28.91 C31.2 | 62.24,35.26 C20.2 | v21.83,26.23 v21.84,26.24
  Bottom 0.406: 62.24,35.26 63.12,35.26 v63.37,35.51 | J4.P$4 93.73,34.37 92.71,35.38 92.71,41.16 C1.2
  Bottom 0.61: v83.13,28.91 84.03,28.91 | C15.2 86.61,49.86 v86.36,50.12 | C50.2 70.73,43.37 v70.61,43.26 | D3.2 17.19,31.15 v17.27,31.07 | C52.1 v23.62,25.99 | K1.1 v21.83,26.23 | C51.2 21.59,26.49 v21.84,26.24 | v27.69,25.99 25.55,23.85 D2.2 | R58.2 85.17,32.26 v84.84,32.08 | C53.2 70.48,32.72 v70.23,32.97 | R19.2 89.52,8.6 v89.92,8.21
  pour PWR (isolate 0.305, rank 2): 0,26.75 0,45.04 7.87,52.91 88.14,52.91 96.01,45.04 96.01,0.08 74.8,0.08 74.8,20.91 65.53,20.91 65.53,24.06 74.93,24.06 74.93,36.91 76.71,38.69 83.82,38.69 83.82,41.99 73.41,41.99 71.12,39.7 71.12,28.91 60.58,28.91 60.58,27.89 30.35,27.64 30.35,25.22 11.18,25.48 11.18,43.77 4.06,43.77 4.06,26.75
VCCIO  (via drill 0.41 pad 0.81)
  Top 0.61: TP2.1 49.84,26.16 51.06,27.39 C8.2 54.57,27.39 U5.1 55.87,27.7 v56.54,28.37 | OP1.1 81.38,4.4 81.79,4.8 v81.79,6.43
  Bottom 0.61: v81.79,6.43 81.79,8.66 84.73,11.61 84.73,17.81 | 84.73,17.81 84.73,18.26 82.8,20.2 80.77,20.2 75.54,25.43 71.12,25.43 70.51,26.04 66.85,26.04 63.6,29.29 60.55,29.29 59.74,28.48 56.64,28.48 v56.54,28.37 | C16.2 84.36,17.44 84.73,17.81
  pour Top (no thermals): 77.98,5.41 77.98,3.38 81.28,3.38 81.28,5.41
VO_TPS  (via drill 0.41 pad 0.81, 0.41 pad 0.91)
  Top 0.406: U4.5 37.92,37.85 | R12.1 34.42,31.95 v34.54,31.83 | 21.25,34.7 C19.2 | 22.85,34.67 C34.2
  Top 0.61: R11.2 21.25,34.7 | C19.2 22.85,34.67
  Top 0.813: C43.1 37.22,38.55 37.92,37.85 | C34.2 22.94,33.78 v23.11,33.61 | v38.1,36.91 38.1,37.47 U4.5
  Top 1.016: L2.2 31.84,46.73 37.22,41.34 C43.1
  Bottom 0.406: C41.1 34.67,34.51 34.67,31.95 v34.54,31.83
  Bottom 0.813: 34.67,34.51 C39.1 C40.1 C42.1 25.74,33.95 25.4,33.61 v23.11,33.61 | C41.1 37.27,34.56 37.85,35.13 37.85,36.65 v38.1,36.91
  other vias: 26.47,49.86 27.33,49.86 28.19,49.86 29.06,49.86 29.92,49.86 31.5,49.3 30.78,49.81 31.6,48.39 31.85,47.42 31.8,46.61 31.75,45.75 31.7,44.88 31.19,44.17 30.33,43.87 30.99,43.41 31.95,43.77 32.46,44.53 32.51,45.44 32.61,46.31 32.41,48.13 31.65,50.22 30.43,50.57 29.46,50.67 28.45,50.73 27.53,50.73 26.62,50.73 26.11,48.95 26.06,48.13 26.01,47.32 25.96,46.46 25.91,45.65 27.94,43.66 28.75,43.66 29.57,43.66 32.66,47.27 25.35,48.64 25.3,47.78 25.25,46.97 25.25,46.2 25.45,49.76 25.7,50.62 12.45,51.54 13.31,51.54 9.6,48.69 9.6,47.73 9.55,46.66 10.52,46.56 10.31,49.51 11.18,50.42 14.63,51.59 15.8,51.64 17.07,51.69 20.83,51.59 21.64,51.64 22.61,51.69 23.57,51.69 11.63,47.07 12.45,47.68 11.79,50.98 24.49,51.69 25.1,51.18 26.06,51.64 27.43,51.74 28.91,51.74 30.38,51.59 32.51,49.2 24.74,50.37 24.69,49.35
  pour Top (isolate 0.813): 11.23,52.2 30.23,52.2 33.58,48.85 33.58,40.06 32.46,38.94 31.45,38.94 31.45,39.45 22.4,48.49 13.82,48.49 11.23,45.9 8.84,45.9 8.79,45.95 8.74,45.95 8.33,46.36 8.33,49 8.64,49.3 9.35,49.3 11.07,51.03 11.07,51.94 11.23,52.1
  pour Bottom (isolate 0.813): 12.4,52.2 8.84,48.64 8.84,44.83 10.57,43.11 32.11,43.11 33.38,44.38 33.78,44.38 33.99,44.58 33.99,50.62 32.41,52.2
VOSEN  (via drill 0.41 pad 0.81)
  Top 0.406: U1.19 88.13,29.03 v87.76,28.65
  Top 0.61: R36.1 C13.2 R37.2 26.96,17.64 27.43,18.11 TP3.1
  Bottom 0.406: 27.43,18.11 TP3.1 28.07,19 28.45,19.38 28.45,20.91 29.46,21.92 32.51,21.92 33.27,22.68 33.27,24.97 34.54,26.24 47.75,26.24 50.8,29.29 59.44,29.29 60.2,30.05 72.8,30.05 74.83,28.02 78.49,28.02 79.76,26.75 86.36,26.75 87.12,27.51 87.12,28.02 v87.76,28.65
  Bottom 0.61: D2.3 26.13,16.17 TP3.1
VOUT  (via drill 0.41 pad 0.91)
  Top 0.406: R12.2 34.42,28.14
  Top 0.61: R37.1 24,16.21 23.15,17.06 D8.C 21.27,19.06 v21.59,19.38 | R1.2 37.2,28.64 36.43,27.87 R12.2 | 34.42,28.14 v33.27,29.29
  Bottom 0.406: 20.32,18.69 K1.4 | 13.21,22.97 K1.7 | 13.21,20.89 K1.6
  Bottom 0.61: v21.59,19.38 20.57,19.38 20.32,19.13 | 20.32,19.13 20.32,18.69 | 13.21,22.97 13.21,22.43 13.1,22.32 13.1,21.52 13.21,21.41 13.21,20.89 | 20.32,19.13 20.07,19.38 17.53,19.38 16.89,20.02 16.89,22.05 15.91,23.03 | K1.7 15.91,23.03 | v33.27,29.29 32.26,30.3 26.67,30.3 25.15,28.78 25.15,25.73 24.38,24.97 17.85,24.97 15.91,23.03 | K1.6 15.04,20.83 TP11.1 | J2.1 15.15,13.12 11.43,16.84 11.43,20.37 11.89,20.83 K1.6 | K1.6
VRELAY  (via drill 0.41 pad 0.91)
  Top 0.61: Q3.3 12.54,24.05 v13.21,24.72
  Bottom 0.406: v13.21,24.72 13.21,26.17 K1.8 | K1.8 13.26,28.33 13.89,28.95 D3.3 | K1.8 14.36,26.23 TP8.1

### Text on the board
tPlace: GND | +5V | + | RST | C | GND | + | + | +
bPlace: r12-AGO18 | V_TPS | #SER: | ISEN | OVC_ALARM | VRELAY | PUSH | 12V | SDA | SCL | TEST | VO+ | VO- | GND | OPTO_OP | VOSEN